# EAGLE schematic 1379_control (EAGLE 9.6.2)

## Sheet 1 of 10
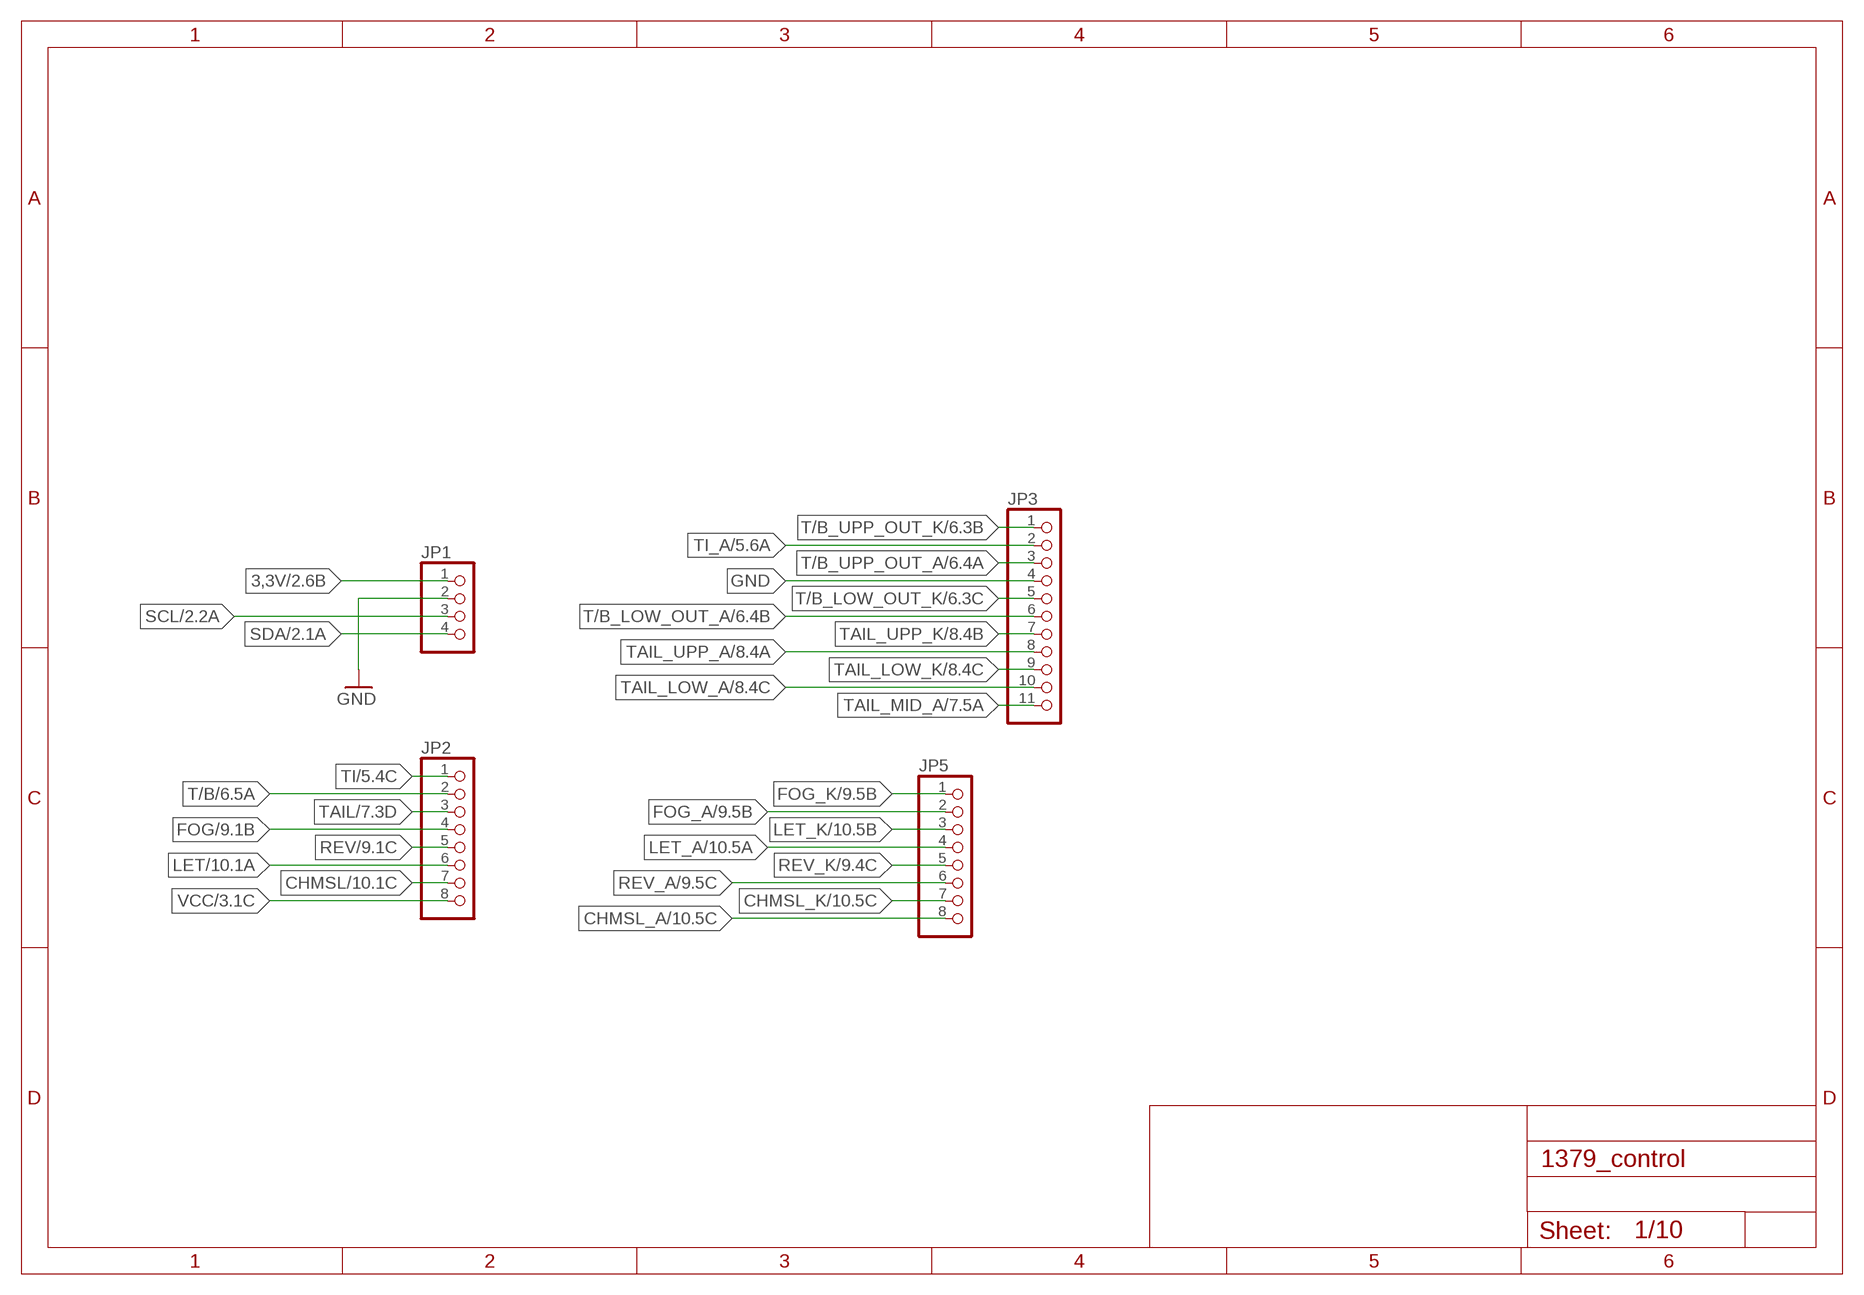
[diagram p0: schematic, sheet 1]

### Parts
JP1  PINHD-1X4  [1X04]
JP2  PINHD-1X8  [1X08]
JP3  PINHD-1X11  [1X11]
JP5  PINHD-1X8  [1X08]

### Nets
3,3V: JP1.1 ; also sheet 2,3,4
CHMSL: JP2.7 ; also sheet 10
CHMSL_A: JP5.8 ; also sheet 10
CHMSL_K: JP5.7 ; also sheet 10
FOG: JP2.4 ; also sheet 9
FOG_A: JP5.2 ; also sheet 9
FOG_K: JP5.1 ; also sheet 9
GND: JP1.2 JP3.4 ; also sheet 2,3,4,5,6,7,8,9,10
LET: JP2.6 ; also sheet 10
LET_A: JP5.4 ; also sheet 10
LET_K: JP5.3 ; also sheet 10
REV: JP2.5 ; also sheet 9
REV_A: JP5.6 ; also sheet 9
REV_K: JP5.5 ; also sheet 9
SCL: JP1.3 ; also sheet 2,3
SDA: JP1.4 ; also sheet 2,3
T/B: JP2.2 ; also sheet 6
T/B_LOW_OUT_A: JP3.6 ; also sheet 6
T/B_LOW_OUT_K: JP3.5 ; also sheet 6
T/B_UPP_OUT_A: JP3.3 ; also sheet 6
T/B_UPP_OUT_K: JP3.1 ; also sheet 6
TAIL: JP2.3 ; also sheet 7
TAIL_LOW_A: JP3.10 ; also sheet 8
TAIL_LOW_K: JP3.9 ; also sheet 8
TAIL_MID_A: JP3.11 ; also sheet 7
TAIL_UPP_A: JP3.8 ; also sheet 8
TAIL_UPP_K: JP3.7 ; also sheet 8
TI: JP2.1 ; also sheet 5
TI_A: JP3.2 ; also sheet 5
VCC: JP2.8 ; also sheet 3

## Sheet 2 of 10
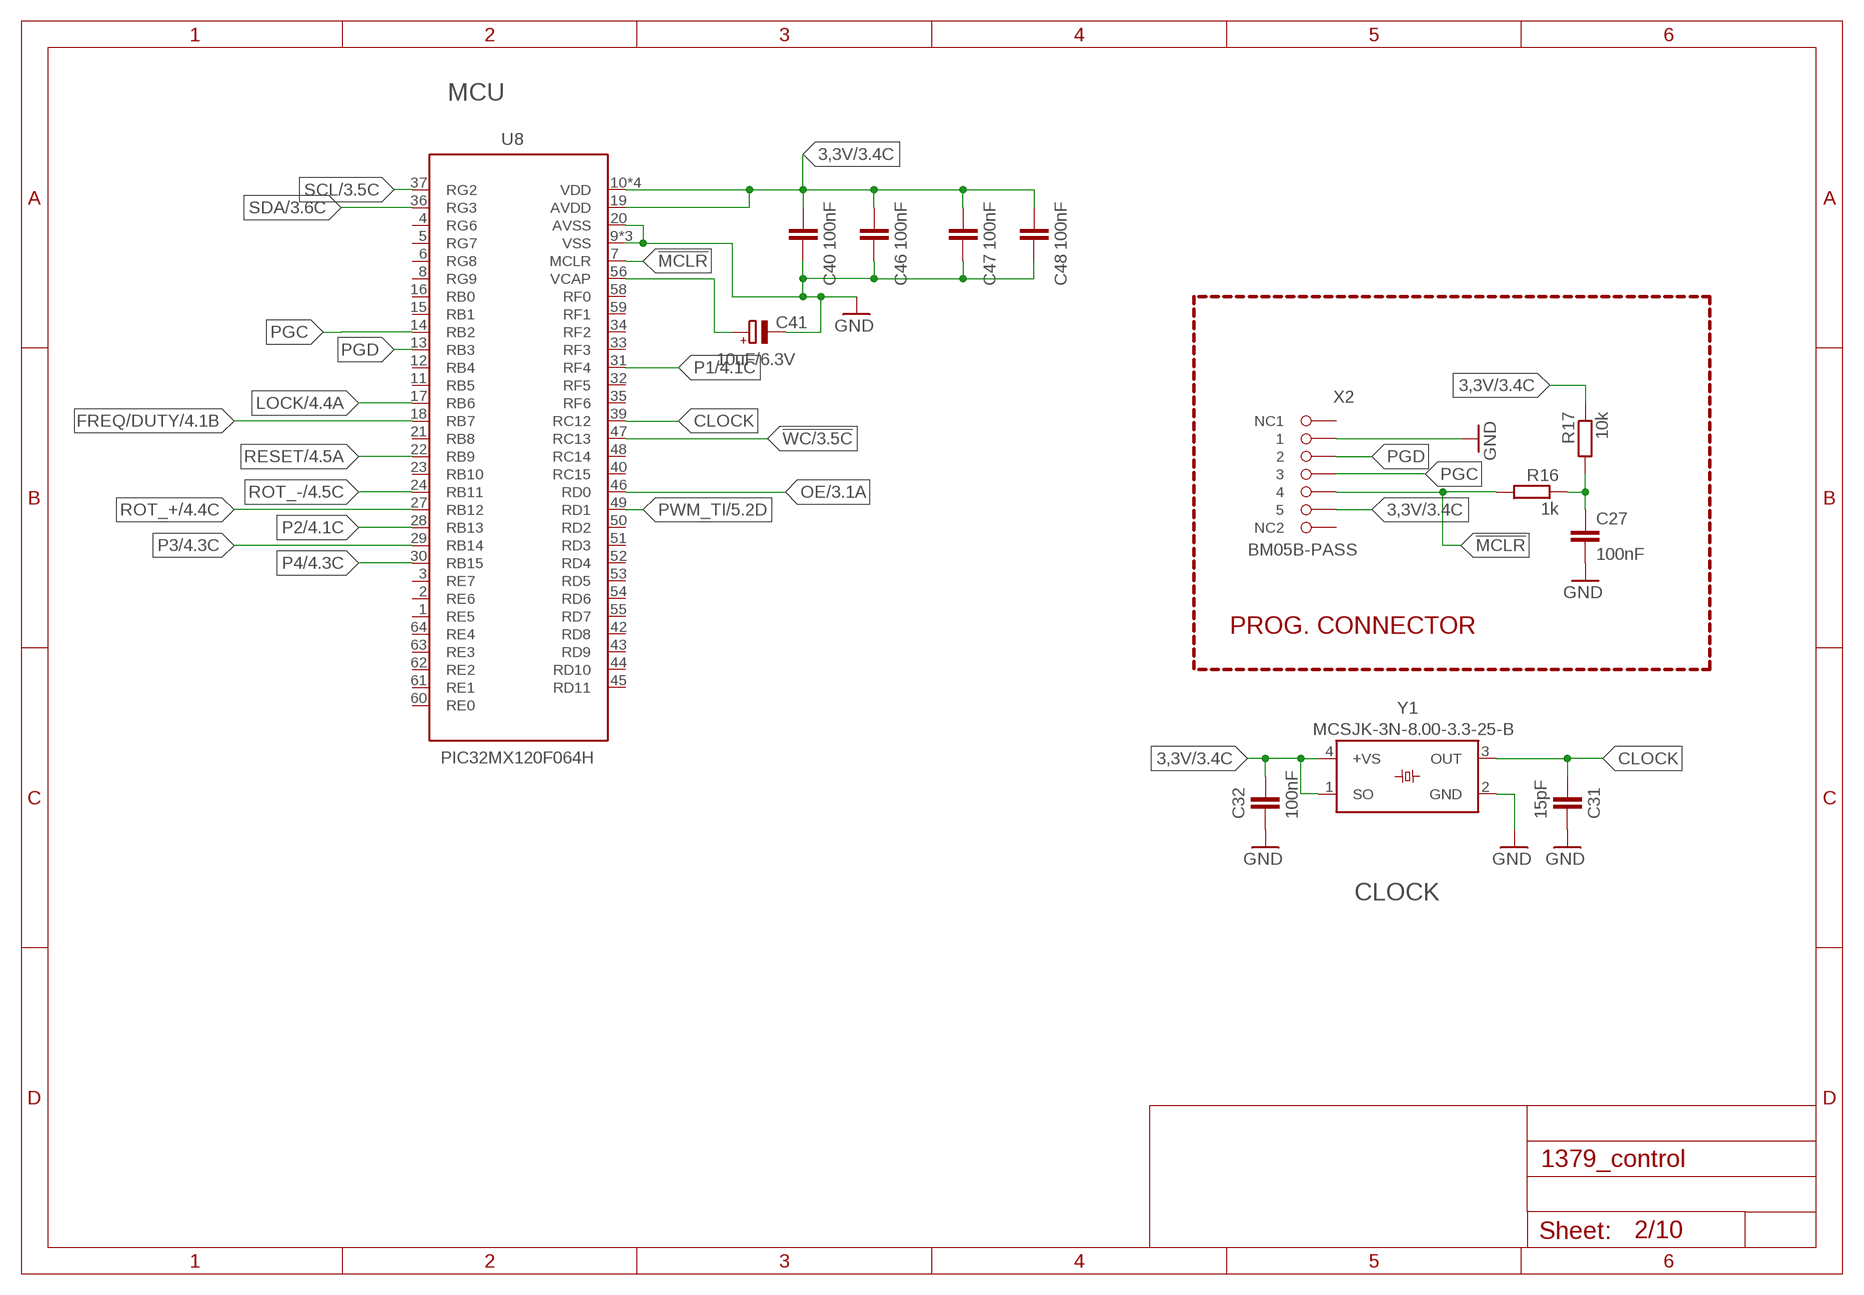
[diagram p1: schematic, sheet 2]

### Parts
C27  100nF  C-EUC0603  [C0603]
C31  15pF  C-EUC0603  [C0603]
C32  100nF  C-EUC0603  [C0603]
C40  100nF  C-EUC0603  [C0603]
C41  10uF/6.3V  CPOL-EUCT3216  [CT3216]
C46  100nF  C-EUC0603  [C0603]
C47  100nF  C-EUC0603  [C0603]
C48  100nF  C-EUC0603  [C0603]
R16  1k  R-EU_R0603  [R0603]
R17  10k  R-EU_R0603  [R0603]
U8  PIC32MX120F064H  [PIC32MX-TQFN]
X2  BM05B-PASS  [BM05B-PASS]
Y1  MCSJK-3N-8.00-3.3-25-B  WE-SPXO_CFPS-104_830205028309  [WE-SPXO_CFPS-104]

### Nets
3,3V: C32.1 C40.1 C46.1 C47.1 C48.1 R17.1 U8.10(VDD) U8.19(AVDD) U8.26(VDD) U8.38(VDD) U8.57(VDD) X2.P$5 Y1.1(SO) Y1.4(+VS) ; also sheet 1,3,4
!MCLR: R16.2 U8.7(MCLR) X2.P$4
!WC: U8.47(RC13) ; also sheet 3
CLOCK: C31.1 U8.39(RC12) Y1.3(OUT)
FREQ/DUTY: U8.18(RB7) ; also sheet 4
GND: C27.2 C31.2 C32.2 C40.2 C41.- C46.2 C47.2 C48.2 U8.9(VSS) U8.20(AVSS) U8.25(VSS) U8.41(VSS) X2.P$1 Y1.2(GND) ; also sheet 1,3,4,5,6,7,8,9,10
LOCK: U8.17(RB6) ; also sheet 4
N$16: C27.1 R16.1 R17.2
N$47: C41.+ U8.56(VCAP)
OE: U8.46(RD0) ; also sheet 3
P1: U8.31(RF4) ; also sheet 4
P2: U8.28(RB13) ; also sheet 4
P3: U8.29(RB14) ; also sheet 4
P4: U8.30(RB15) ; also sheet 4
PGC: U8.14(RB2) X2.P$3
PGD: U8.13(RB3) X2.P$2
PWM_TI: U8.49(RD1) ; also sheet 5
RESET: U8.22(RB9) ; also sheet 4
ROT_+: U8.27(RB12) ; also sheet 4
ROT_-: U8.24(RB11) ; also sheet 4
SCL: U8.37(RG2) ; also sheet 1,3
SDA: U8.36(RG3) ; also sheet 1,3
Unconnected: U8.1(RE5) U8.2(RE6) U8.4(RG6) U8.5(RG7) U8.6(RG8) U8.8(RG9) U8.11(RB5) U8.12(RB4) U8.15(RB1) U8.16(RB0) U8.21(RB8) U8.23(RB10) U8.32(RF5) U8.33(RF3) U8.34(RF2) U8.35(RF6) U8.40(RC15) U8.42(RD8) U8.43(RD9) U8.44(RD10) U8.45(RD11) U8.48(RC14) U8.50(RD2) U8.51(RD3) U8.52(RD4) U8.53(RD5) U8.54(RD6) U8.55(RD7) U8.58(RF0) U8.59(RF1) U8.60(RE0) U8.61(RE1) U8.62(RE2) U8.63(RE3) U8.64(RE4) X2.A(NC1) X2.B(NC2)

### Notes on the sheet
- MCU
- PROG. CONNECTOR
- CLOCK

## Sheet 3 of 10
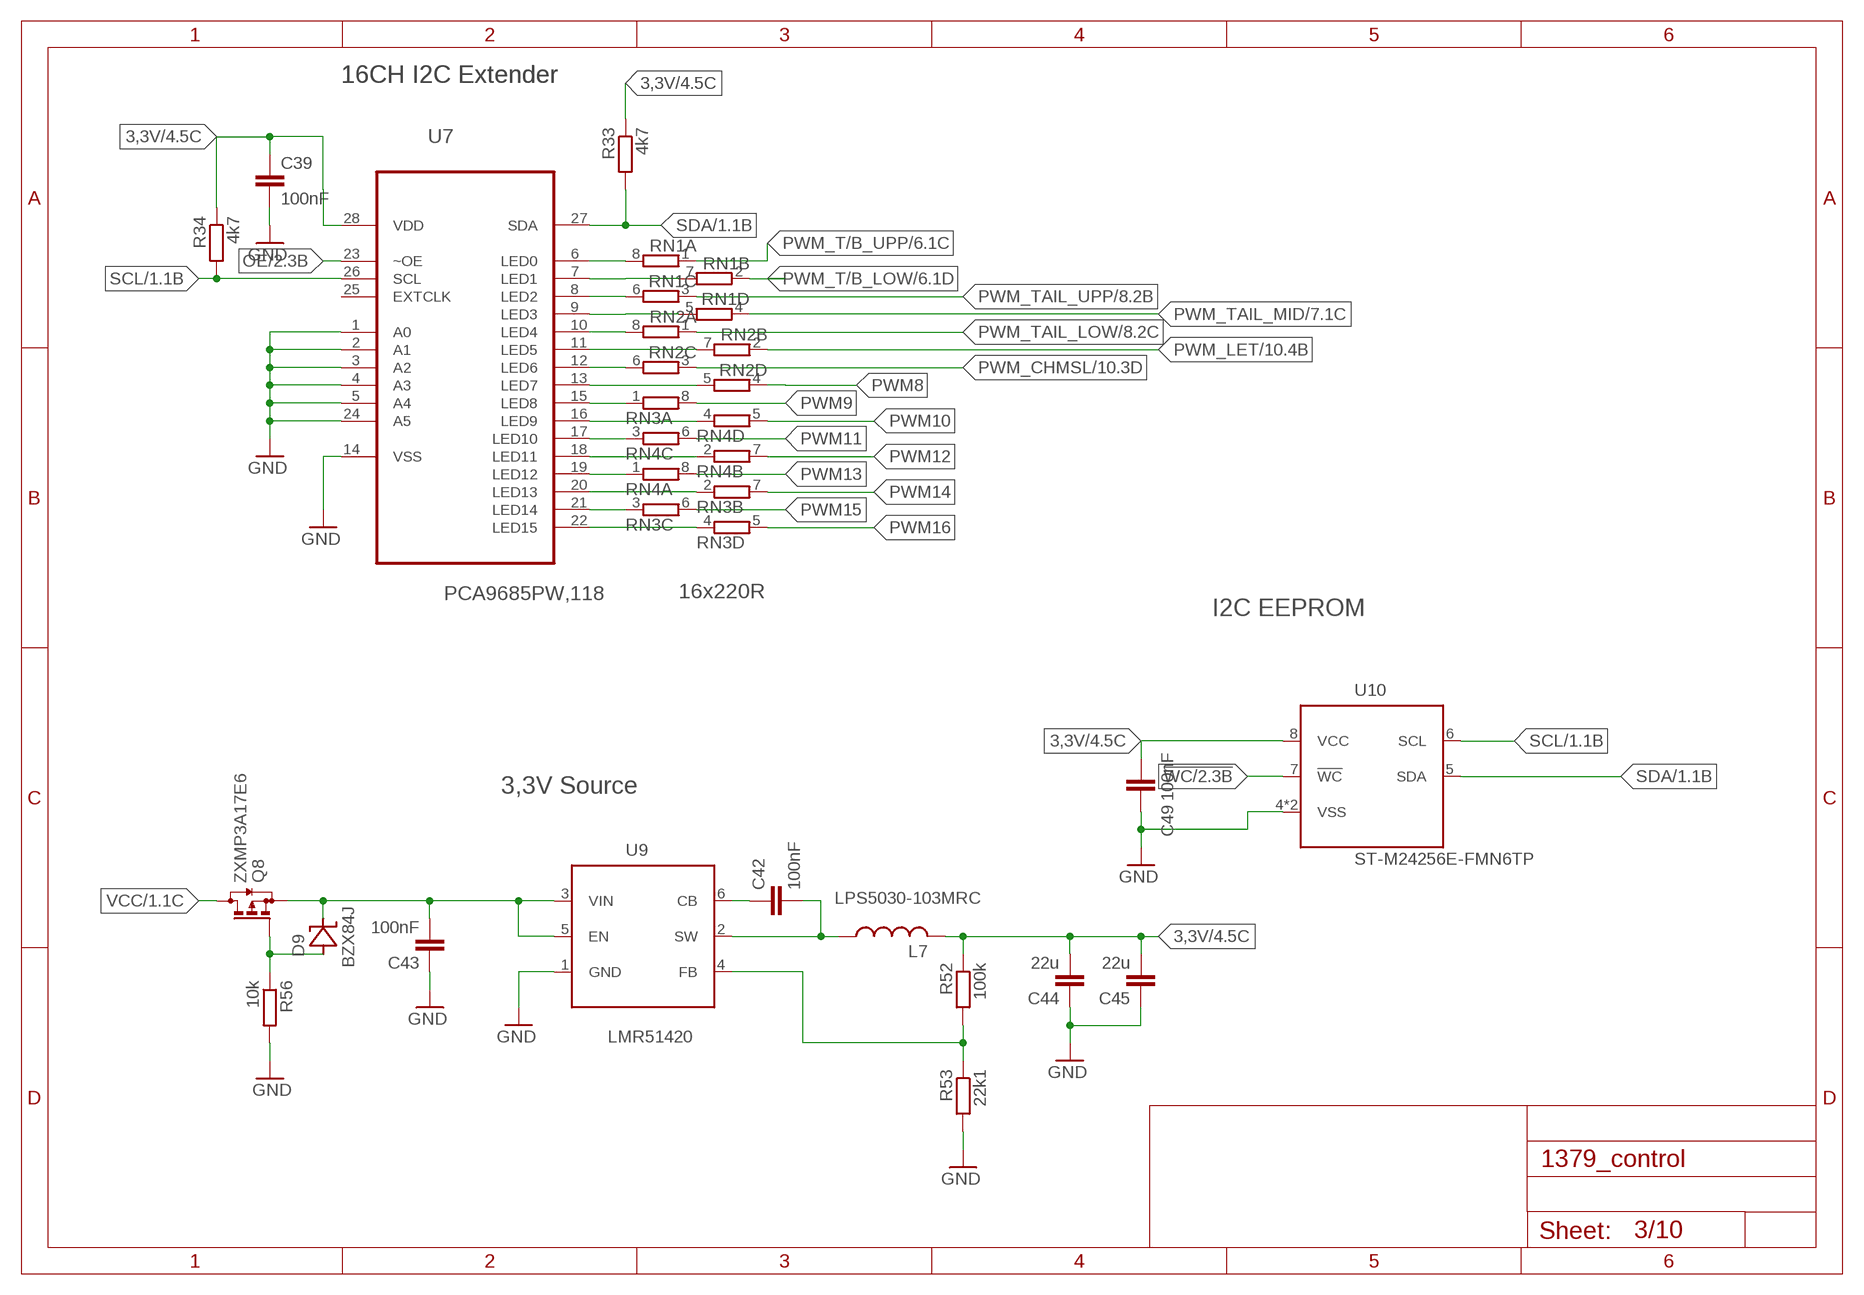
[diagram p2: schematic, sheet 3]

### Parts
C39  100nF  C-EUC0603  [C0603]
C42  100nF  C-EUC0603  [C0603]
C43  100nF  C-EUC0603  [C0603]
C44  22u  C-EUC0603  [C0603]
C45  22u  C-EUC0603  [C0603]
C49  100nF  C-EUC0603  [C0603]
D9  BZX84J  [SOD323]
L7  LPS5030-103MRC  POWER_INDUCTOR5X5  [L_5X5]
Q8  ZXMP3A17E6  [SOT23-6]
R33  4k7  R-EU_R0603  [R0603]
R34  4k7  R-EU_R0603  [R0603]
R52  100k  R-EU_R0603  [R0603]
R53  22k1  R-EU_R0603  [R0603]
R56  10k  R-EU_R0603  [R0603]
RN1  4R-NEXBS8V  [EXBS8V]
RN2  4R-NEXBS8V  [EXBS8V]
RN3  4R-NEXBS8V  [EXBS8V]
RN4  4R-NEXBS8V  [EXBS8V]
U7  PCA9685PW,118  [SOP65P640X110-28N]
U9  LMR51420  [SOT23-6]
U10  ST-M24256E-FMN6TP  [SO-8]

### Nets
3,3V: C39.1 C44.2 C45.2 C49.1 L7.2 R33.1 R34.1 R52.1 U7.28(VDD) U10.8(VCC) ; also sheet 1,2,4
!WC: U10.7(!WC) ; also sheet 2
GND: C39.2 C43.1 C44.1 C45.1 C49.2 R53.2 R56.2 U7.1(A0) U7.2(A1) U7.3(A2) U7.4(A3) U7.5(A4) U7.14(VSS) U7.24(A5) U9.1(GND) U10.4(VSS) U10.EP(VSS) ; also sheet 1,2,4,5,6,7,8,9,10
N$21: RN1.8 U7.6(LED0)
N$22: RN3.1 U7.15(LED8)
N$23: RN1.7 U7.7(LED1)
N$26: RN4.4 U7.16(LED9)
N$27: RN1.6 U7.8(LED2)
N$29: RN4.3 U7.17(LED10)
N$34: RN1.5 U7.9(LED3)
N$35: RN2.8 U7.10(LED4)
N$36: RN2.7 U7.11(LED5)
N$37: RN2.6 U7.12(LED6)
N$38: RN2.5 U7.13(LED7)
N$39: RN4.2 U7.18(LED11)
N$40: RN4.1 U7.19(LED12)
N$41: RN3.2 U7.20(LED13)
N$44: RN3.3 U7.21(LED14)
N$45: RN3.4 U7.22(LED15)
N$48: R52.2 R53.1 U9.4(FB)
N$52: C42.2 L7.1 U9.2(SW)
N$53: C42.1 U9.6(CB)
N$54: D9.A Q8.3(G) R56.1
N$55: C43.2 D9.C Q8.4(S) U9.3(VIN) U9.5(EN)
OE: U7.23(~OE) ; also sheet 2
PWM8: RN2.4
PWM9: RN3.8
PWM10: RN4.5
PWM11: RN4.6
PWM12: RN4.7
PWM13: RN4.8
PWM14: RN3.7
PWM15: RN3.6
PWM16: RN3.5
PWM_CHMSL: RN2.3 ; also sheet 10
PWM_LET: RN2.2 ; also sheet 10
PWM_T/B_LOW: RN1.2 ; also sheet 6
PWM_T/B_UPP: RN1.1 ; also sheet 6
PWM_TAIL_LOW: RN2.1 ; also sheet 8
PWM_TAIL_MID: RN1.4 ; also sheet 7
PWM_TAIL_UPP: RN1.3 ; also sheet 8
SCL: R34.2 U7.26(SCL) U10.6(SCL) ; also sheet 1,2
SDA: R33.2 U7.27(SDA) U10.5(SDA) ; also sheet 1,2
VCC: Q8.1(D) Q8.2(D) Q8.5(D) Q8.6(D) ; also sheet 1
Unconnected: U7.25(EXTCLK)

### Notes on the sheet
- 16CH I2C Extender | 16CH I2C Extender
- 16x220R
- I2C EEPROM
- 3,3V Source

## Sheet 4 of 10
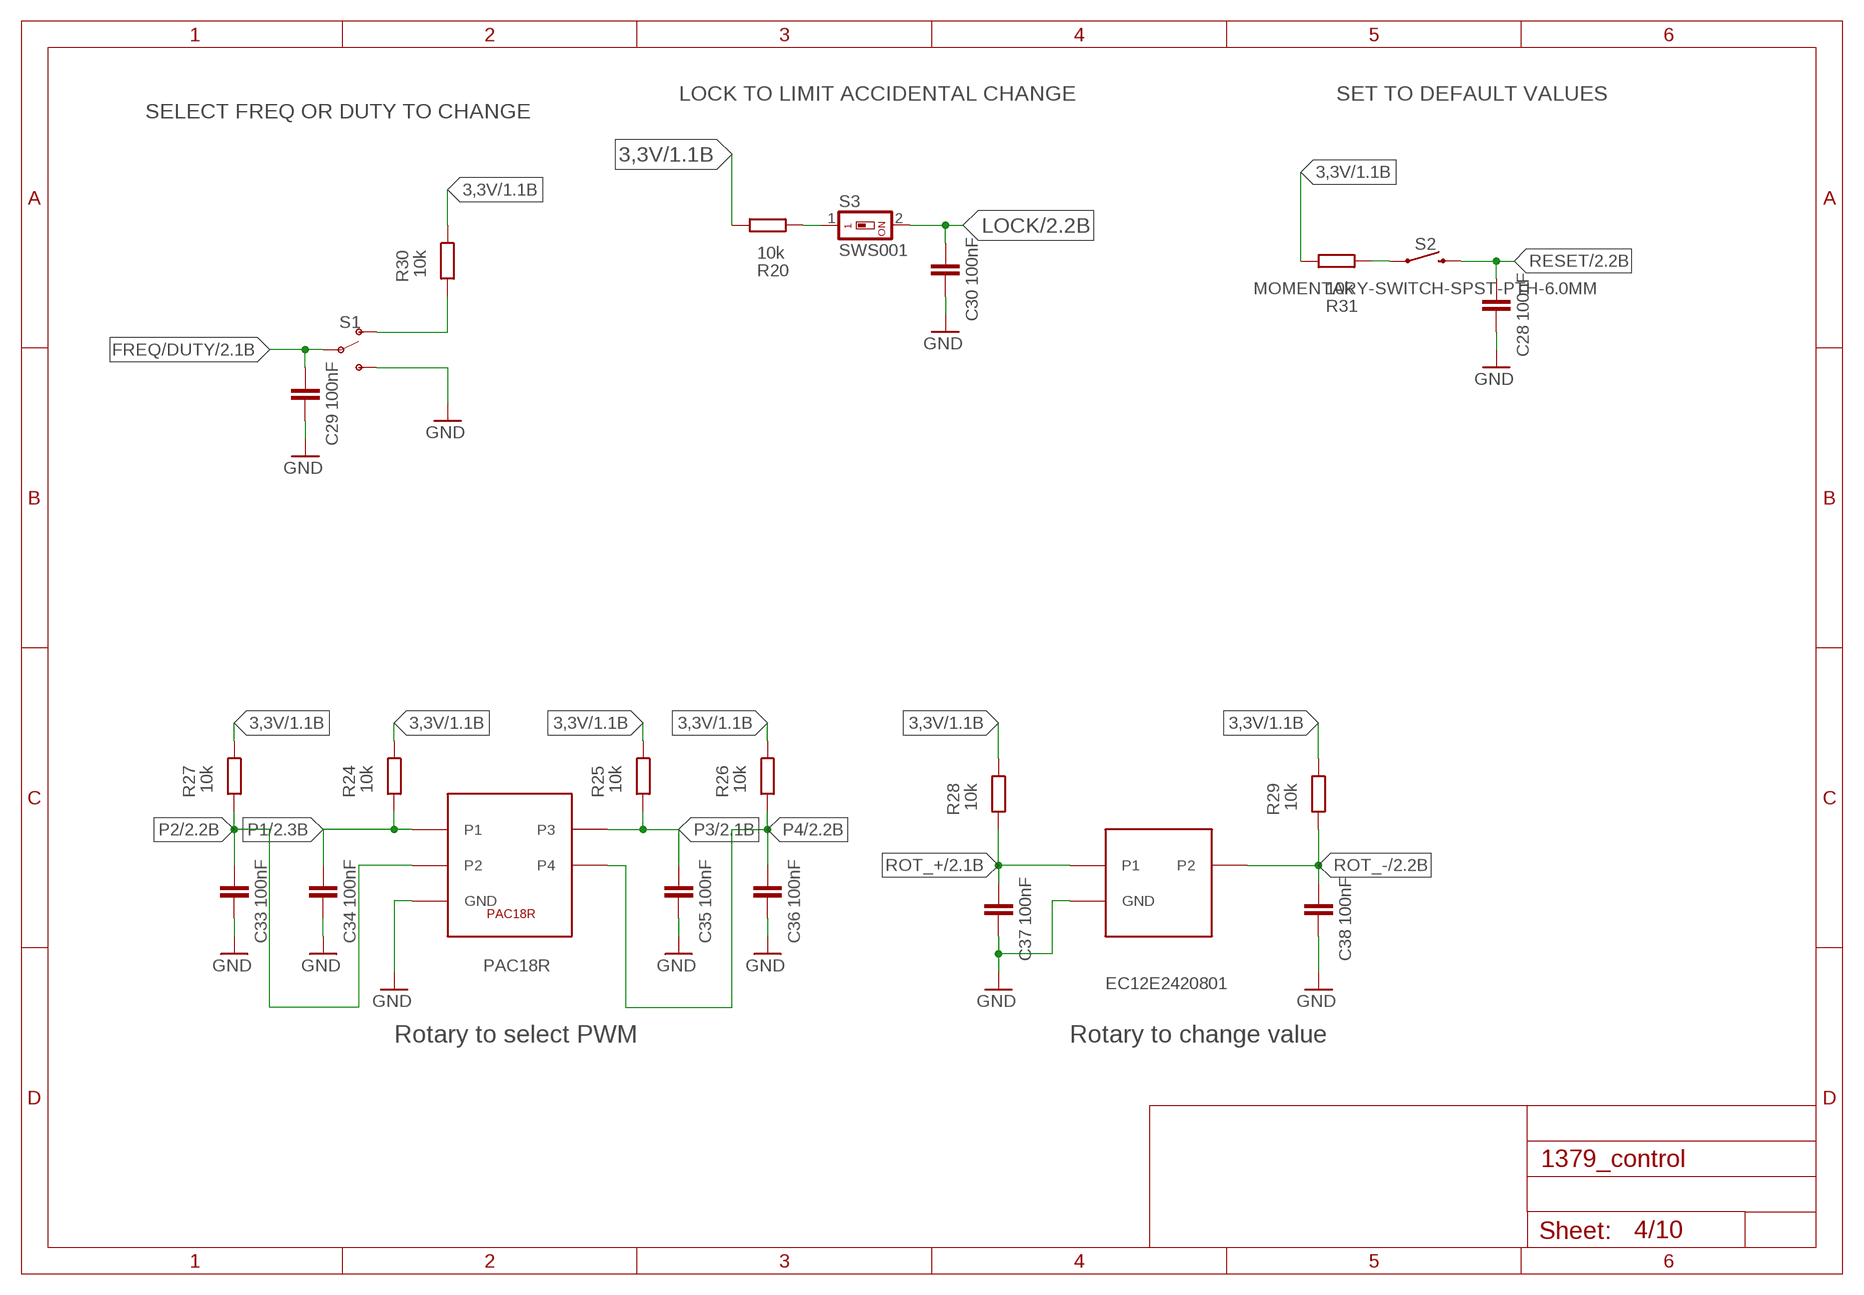
[diagram p3: schematic, sheet 4]

### Parts
C28  100nF  C-EUC0603  [C0603]
C29  100nF  C-EUC0603  [C0603]
C30  100nF  C-EUC0603  [C0603]
C33  100nF  C-EUC0603  [C0603]
C34  100nF  C-EUC0603  [C0603]
C35  100nF  C-EUC0603  [C0603]
C36  100nF  C-EUC0603  [C0603]
C37  100nF  C-EUC0603  [C0603]
C38  100nF  C-EUC0603  [C0603]
R20  10k  R-EU_R0603  [R0603]
R24  10k  R-EU_R0603  [R0603]
R25  10k  R-EU_R0603  [R0603]
R26  10k  R-EU_R0603  [R0603]
R27  10k  R-EU_R0603  [R0603]
R28  10k  R-EU_R0603  [R0603]
R29  10k  R-EU_R0603  [R0603]
R30  10k  R-EU_R0603  [R0603]
R31  10k  R-EU_R0603  [R0603]
S1  SWITCH-SPDT-PTH-11.6X4.0MM  [SWITCH_SPDT_PTH_11.6X4.0MM]
S2  MOMENTARY-SWITCH-SPST-PTH-6.0MM  [TACTILE_SWITCH_PTH_6.0MM]
S3  SWS001  [SMS-001]
X1  ENODER_ROTARY  [ENCODER]
X3  ENCODER-2  [ENCODER-2]

### Nets
3,3V: R20.1 R24.1 R25.1 R26.1 R27.1 R28.1 R29.1 R30.1 R31.1 ; also sheet 1,2,3
FREQ/DUTY: C29.1 S1.2(P) ; also sheet 2
GND: C28.2 C29.2 C30.2 C33.2 C34.2 C35.2 C36.2 C37.2 C38.2 S1.3(S) X1.P$3(GND) X3.P$2(GND) ; also sheet 1,2,3,5,6,7,8,9,10
LOCK: C30.1 S3.2 ; also sheet 2
N$18: R31.2 S2.1
N$19: R30.2 S1.1(O)
N$20: R20.2 S3.1
P1: C34.1 R24.2 X1.P$5(P1) ; also sheet 2
P2: C33.1 R27.2 X1.P$1(P2) ; also sheet 2
P3: C35.1 R25.2 X1.P$4(P3) ; also sheet 2
P4: C36.1 R26.2 X1.P$2(P4) ; also sheet 2
RESET: C28.1 S2.3 ; also sheet 2
ROT_+: C37.1 R28.2 X3.P$1(P1) ; also sheet 2
ROT_-: C38.1 R29.2 X3.P$3(P2) ; also sheet 2

### Notes on the sheet
- LOCK TO LIMIT ACCIDENTAL CHANGE | SET TO DEFAULT VALUES
- SELECT FREQ OR DUTY TO CHANGE
- PAC18R
- EC12E2420801
- Rotary to select PWM | Rotary to change value

## Sheet 5 of 10
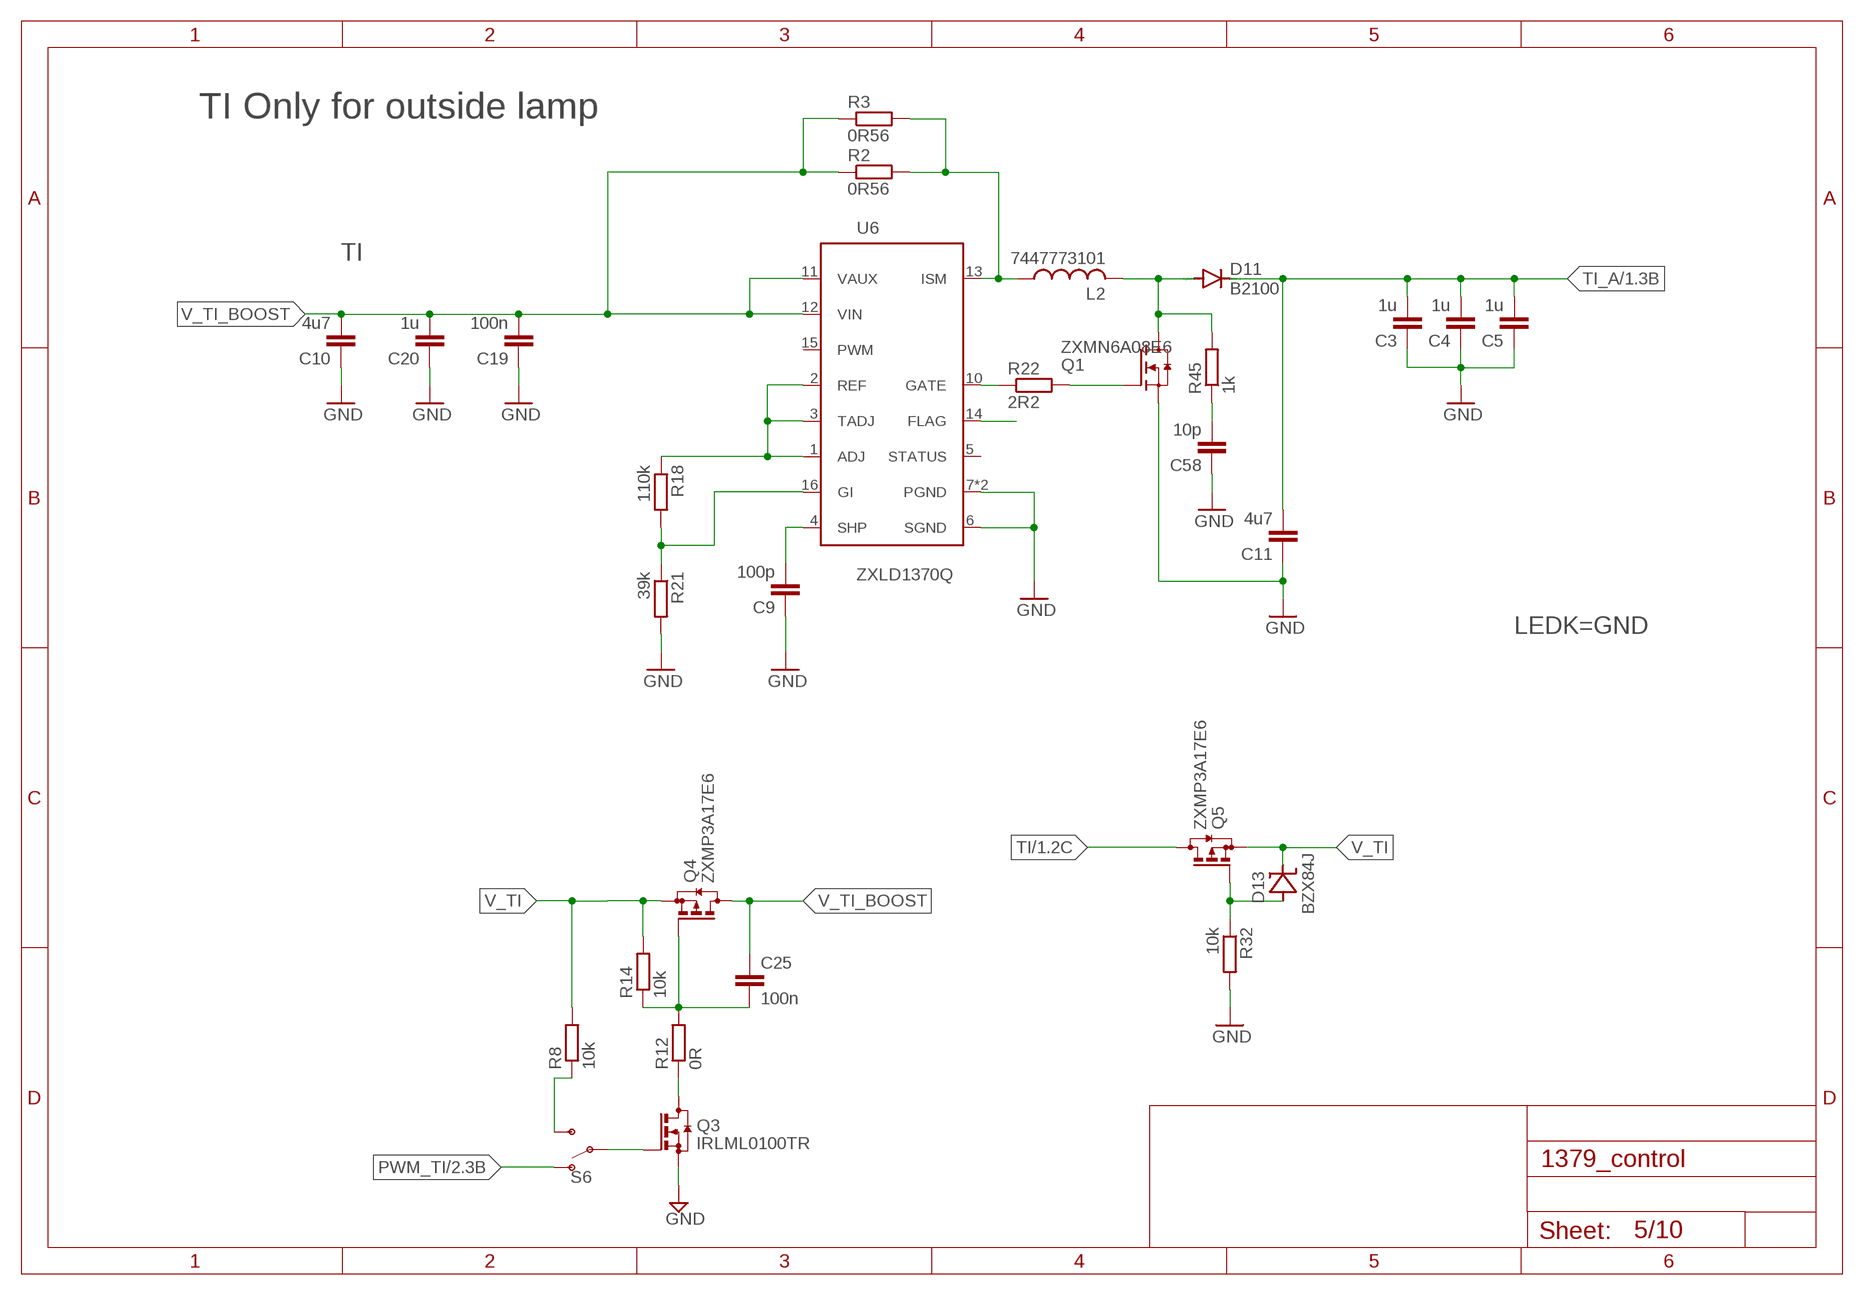
[diagram p4: schematic, sheet 5]

### Parts
C3  1u  C-EUC1206  [C1206]
C4  1u  C-EUC1206  [C1206]
C5  1u  C-EUC1206  [C1206]
C9  100p  C-EUC0603  [C0603]
C10  4u7  C-EUC0603  [C0603]
C11  4u7  C-EUC0603  [C0603]
C19  100n  C-EUC0603  [C0603]
C20  1u  C-EUC0603  [C0603]
C25  100n  C-EUC0603  [C0603]
C58  10p  C-EUC0603  [C0603]
D11  B2100  DIODE-SMB  [SMB]
D13  BZX84J  [SOD323]
L2  7447773101  POWER_INDUCTOR7.4X7.4  [L_7.4X7.4]
Q1  ZXMN6A08E6  [SOT23-6]
Q3  IRLML0100TR  [SOT23]
Q4  ZXMP3A17E6  [SOT23-6]
Q5  ZXMP3A17E6  [SOT23-6]
R2  0R56  R-EU_R0805  [R0805]
R3  0R56  R-EU_R0805  [R0805]
R8  10k  R-EU_R0603  [R0603]
R12  0R  R-EU_R0603  [R0603]
R14  10k  R-EU_R0603  [R0603]
R18  110k  R-EU_R0603  [R0603]
R21  39k  R-EU_R0603  [R0603]
R22  2R2  R-EU_R0603  [R0603]
R32  10k  R-EU_R0603  [R0603]
R45  1k  R-EU_R0603  [R0603]
S6  SWITCH-SPDT-PTH-11.6X4.0MM  [SWITCH_SPDT_PTH_11.6X4.0MM]
U6  ZXLD1370Q  [TSSOP16E]

### Nets
GND: C3.1 C4.1 C5.1 C9.1 C10.1 C11.1 C19.1 C20.1 C58.1 Q1.4(S) Q3.2(S) R21.2 R32.2 U6.6(SGND) U6.7(PGND) U6.EXP(PGND) ; also sheet 1,2,3,4,6,7,8,9,10
N$10: R8.1 S6.3(S)
N$15: C9.2 U6.4(SHP)
N$24: L2.1 R2.2 R3.2 U6.13(ISM)
N$25: D11.A L2.2 Q1.1(D) Q1.2(D) Q1.5(D) Q1.6(D) R45.2
N$28: R18.2 R21.1 U6.16(GI)
N$30: R18.1 U6.1(ADJ) U6.2(REF) U6.3(TADJ)
N$31: R22.1 U6.10(GATE)
N$32: Q1.3(G) R22.2
N$42: Q3.3(D) R12.1
N$43: C25.2 Q4.3(G) R12.2 R14.1
N$46: D13.A Q5.3(G) R32.1
N$51: U6.14(FLAG)
N$65: C58.2 R45.1
N$67: Q3.1(G) S6.2(P)
PWM_TI: S6.1(O) ; also sheet 2
TI: Q5.1(D) Q5.2(D) Q5.5(D) Q5.6(D) ; also sheet 1
TI_A: C3.2 C4.2 C5.2 C11.2 D11.C ; also sheet 1
V_TI: D13.C Q4.4(S) Q5.4(S) R8.2 R14.2
V_TI_BOOST: C10.2 C19.2 C20.2 C25.1 Q4.1(D) Q4.2(D) Q4.5(D) Q4.6(D) R2.1 R3.1 U6.11(VAUX) U6.12(VIN)
Unconnected: U6.5(STATUS)

### Notes on the sheet
- TI Only for outside lamp
- TI
- LEDK=GND

## Sheet 6 of 10
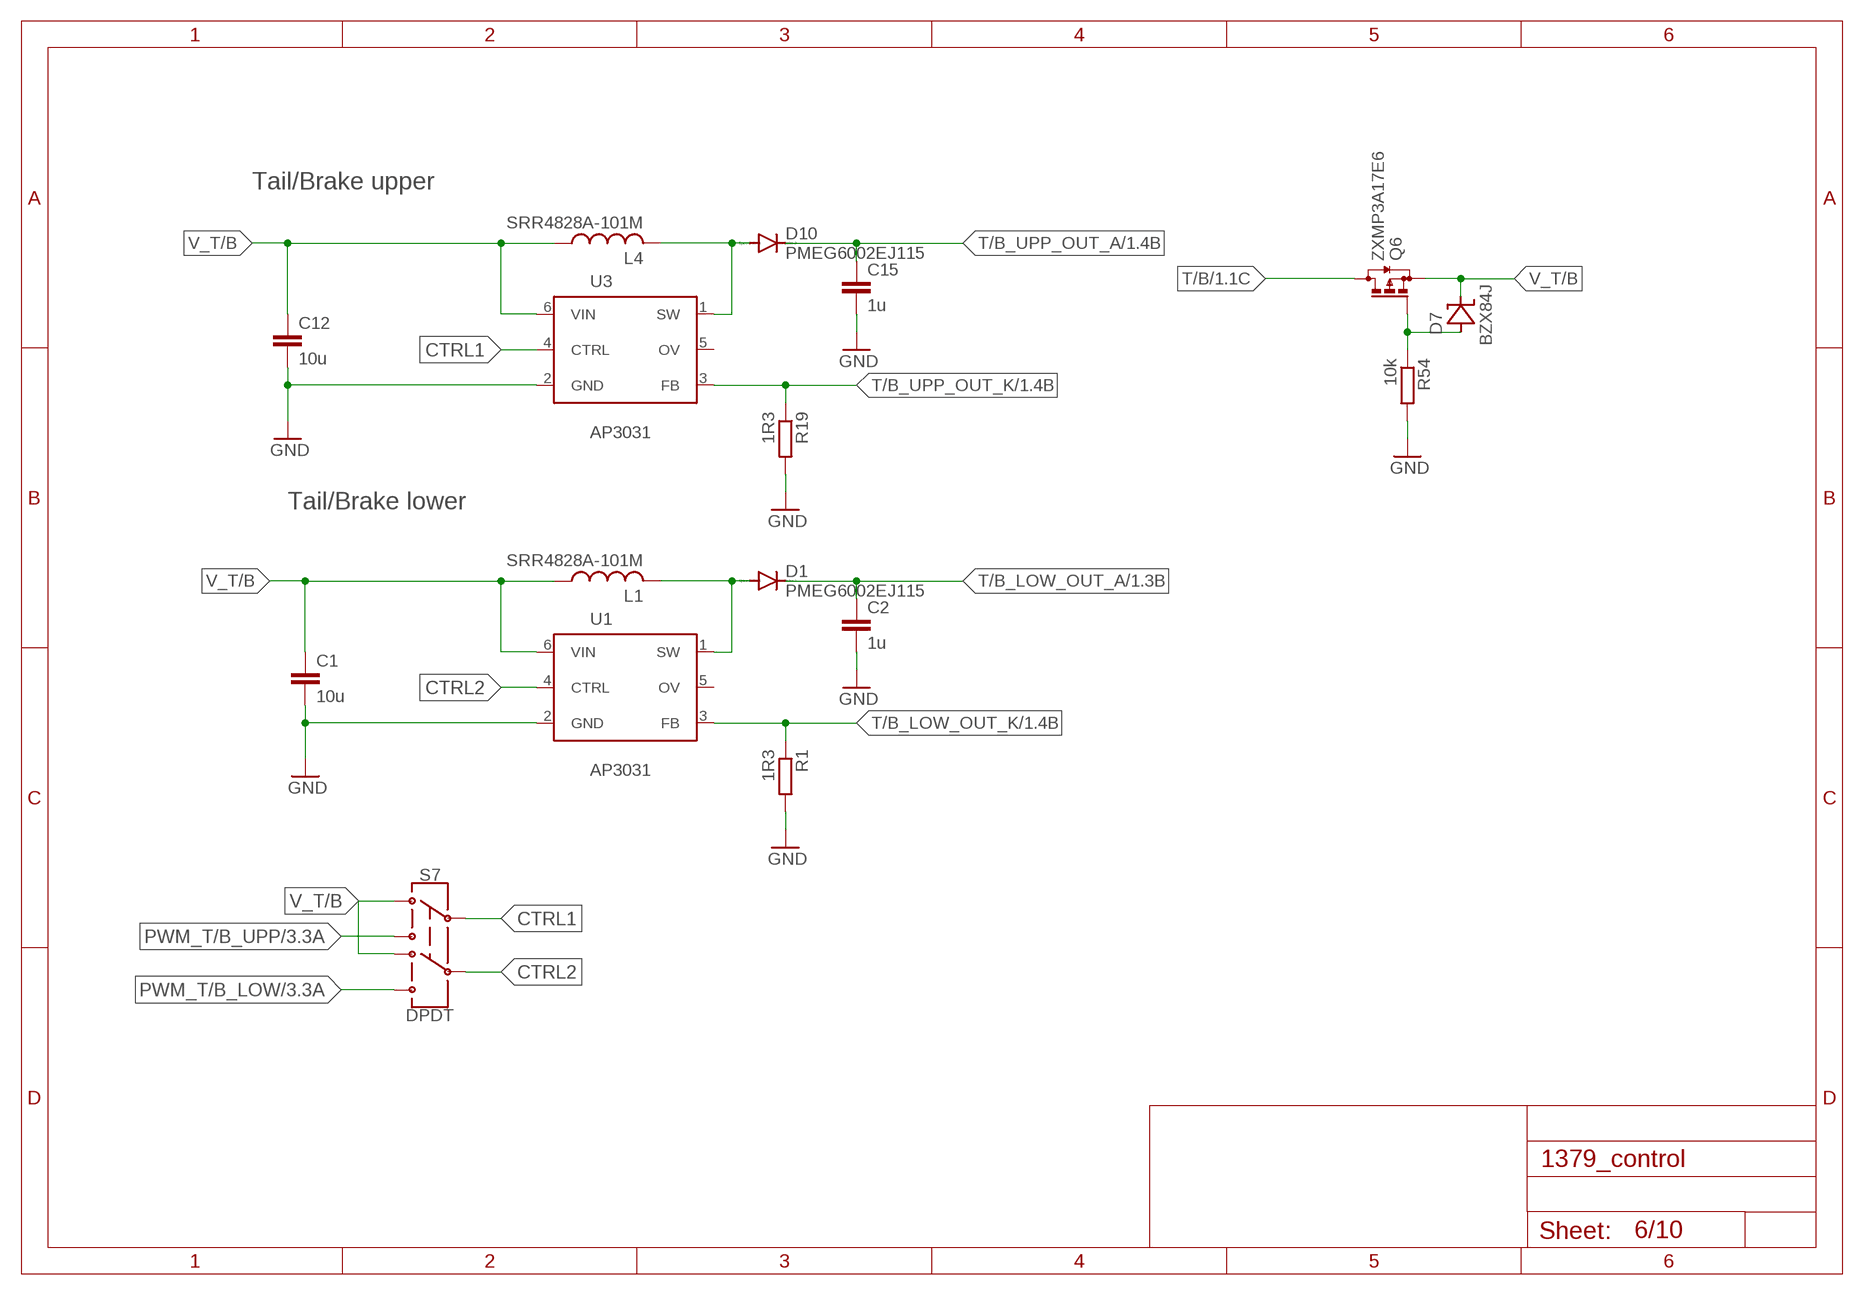
[diagram p5: schematic, sheet 6]

### Parts
C1  10u  C-EUC0805  [C0805]
C2  1u  C-EUC0805  [C0805]
C12  10u  C-EUC0805  [C0805]
C15  1u  C-EUC0805  [C0805]
D1  PMEG6002EJ115  DIODE-SOD323-R  [SOD323-R]
D7  BZX84J  [SOD323]
D10  PMEG6002EJ115  DIODE-SOD323-R  [SOD323-R]
L1  SRR4828A-101M  POWER_INDUCTOR5X5  [L_5X5]
L4  SRR4828A-101M  POWER_INDUCTOR5X5  [L_5X5]
Q6  ZXMP3A17E6  [SOT23-6]
R1  1R3  R-EU_R0805  [R0805]
R19  1R3  R-EU_R0805  [R0805]
R54  10k  R-EU_R0603  [R0603]
S7  DPDT  [SWITCH_DPDT_PTH_GPI-152-3013]
U1  AP3031  [SOT23-6]
U3  AP3031  [SOT23-6]

### Nets
CTRL1: S7.C@1 U3.4(CTRL)
CTRL2: S7.C@2 U1.4(CTRL)
GND: C1.2 C2.2 C12.2 C15.2 R1.2 R19.2 R54.2 U1.2(GND) U3.2(GND) ; also sheet 1,2,3,4,5,7,8,9,10
N$1: D1.A L1.2 U1.1(SW)
N$8: D10.A L4.2 U3.1(SW)
N$49: D7.A Q6.3(G) R54.1
PWM_T/B_LOW: S7.21 ; also sheet 3
PWM_T/B_UPP: S7.11 ; also sheet 3
T/B: Q6.1(D) Q6.2(D) Q6.5(D) Q6.6(D) ; also sheet 1
T/B_LOW_OUT_A: C2.1 D1.C ; also sheet 1
T/B_LOW_OUT_K: R1.1 U1.3(FB) ; also sheet 1
T/B_UPP_OUT_A: C15.1 D10.C ; also sheet 1
T/B_UPP_OUT_K: R19.1 U3.3(FB) ; also sheet 1
V_T/B: C1.1 C12.1 D7.C L1.1 L4.1 Q6.4(S) S7.10 S7.20 U1.6(VIN) U3.6(VIN)
Unconnected: U1.5(OV) U3.5(OV)

### Notes on the sheet
- Tail/Brake upper
- Tail/Brake lower

## Sheet 7 of 10
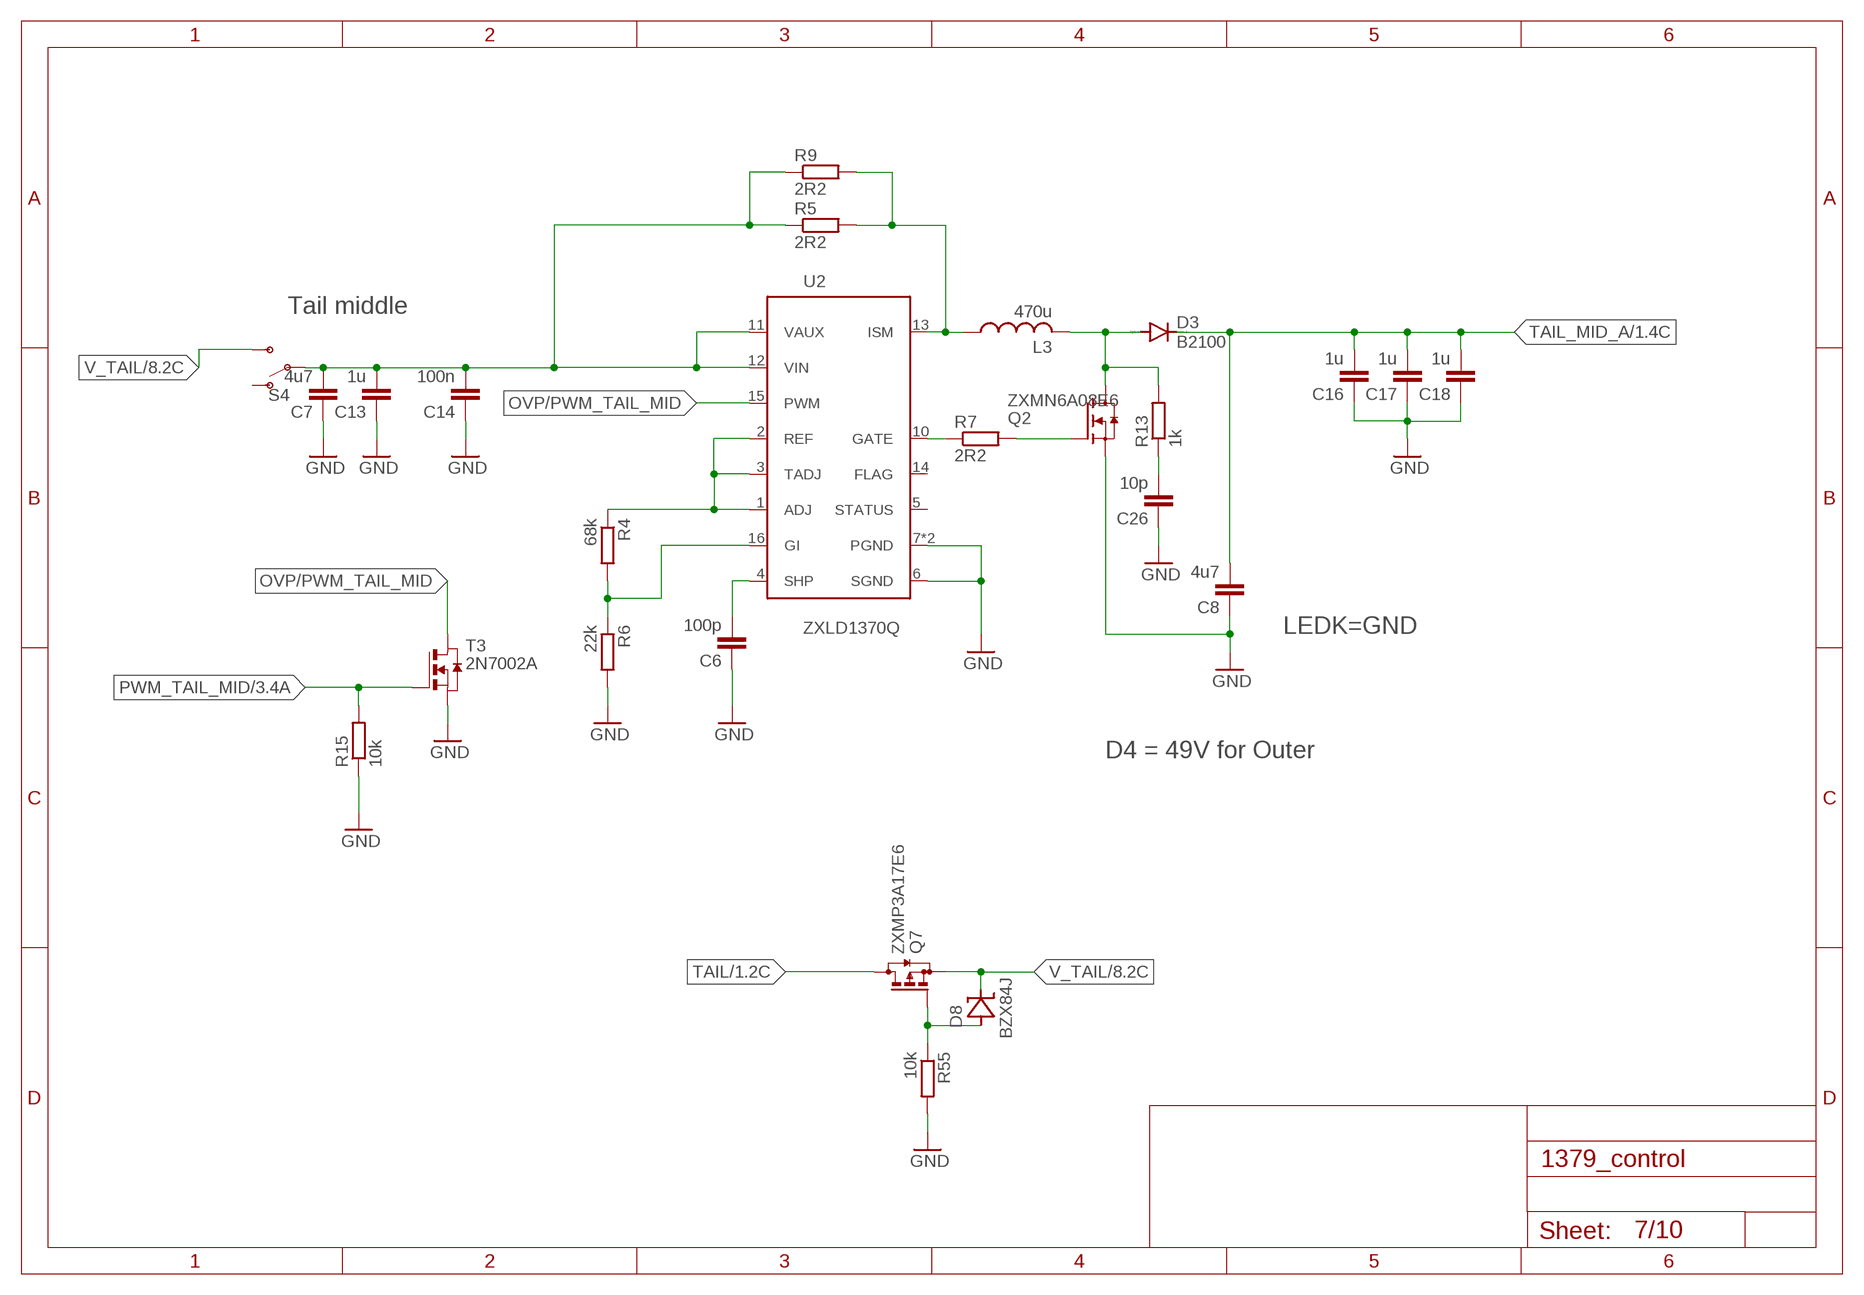
[diagram p6: schematic, sheet 7]

### Parts
C6  100p  C-EUC0603  [C0603]
C7  4u7  C-EUC0603  [C0603]
C8  4u7  C-EUC0603  [C0603]
C13  1u  C-EUC0603  [C0603]
C14  100n  C-EUC0603  [C0603]
C16  1u  C-EUC1206  [C1206]
C17  1u  C-EUC1206  [C1206]
C18  1u  C-EUC1206  [C1206]
C26  10p  C-EUC0603  [C0603]
D3  B2100  DIODE-SMB  [SMB]
D8  BZX84J  [SOD323]
L3  470u  POWER_INDUCTOR7.4X7.4  [L_7.4X7.4]
Q2  ZXMN6A08E6  [SOT23-6]
Q7  ZXMP3A17E6  [SOT23-6]
R4  68k  R-EU_R0603  [R0603]
R5  2R2  R-EU_R0805  [R0805]
R6  22k  R-EU_R0603  [R0603]
R7  2R2  R-EU_R0603  [R0603]
R9  2R2  R-EU_R0805  [R0805]
R13  1k  R-EU_R0603  [R0603]
R15  10k  R-EU_R0603  [R0603]
R55  10k  R-EU_R0603  [R0603]
S4  SWITCH-SPDT-PTH-11.6X4.0MM  [SWITCH_SPDT_PTH_11.6X4.0MM]
T3  2N7002A  NMOSSOT23  [SOT-23]
U2  ZXLD1370Q  [TSSOP16E]

### Nets
GND: C6.1 C7.1 C8.1 C13.1 C14.1 C16.1 C17.1 C18.1 C26.1 Q2.4(S) R6.2 R15.1 R55.2 T3.2(S) U2.6(SGND) U2.7(PGND) U2.EXP(PGND) ; also sheet 1,2,3,4,5,6,8,9,10
N$2: C6.2 U2.4(SHP)
N$3: L3.1 R5.2 R9.2 U2.13(ISM)
N$4: D3.A L3.2 Q2.1(D) Q2.2(D) Q2.5(D) Q2.6(D) R13.2
N$5: R4.2 R6.1 U2.16(GI)
N$6: R4.1 U2.1(ADJ) U2.2(REF) U2.3(TADJ)
N$7: R7.1 U2.10(GATE)
N$9: Q2.3(G) R7.2
N$17: C26.2 R13.1
N$50: D8.A Q7.3(G) R55.1
OVP/PWM_TAIL_MID: T3.1(D) U2.15(PWM)
PWM_TAIL_MID: R15.2 T3.3(G) ; also sheet 3
TAIL: Q7.1(D) Q7.2(D) Q7.5(D) Q7.6(D) ; also sheet 1
TAIL_MID_A: C8.2 C16.2 C17.2 C18.2 D3.C ; also sheet 1
V_TAIL: D8.C Q7.4(S) S4.3(S) ; also sheet 8
V_TAIL1: C7.2 C13.2 C14.2 R5.1 R9.1 S4.2(P) U2.11(VAUX) U2.12(VIN)
Unconnected: S4.1(O) U2.5(STATUS)

### Notes on the sheet
- Tail middle
- LEDK=GND
- D4 = 49V for Outer

## Sheet 8 of 10
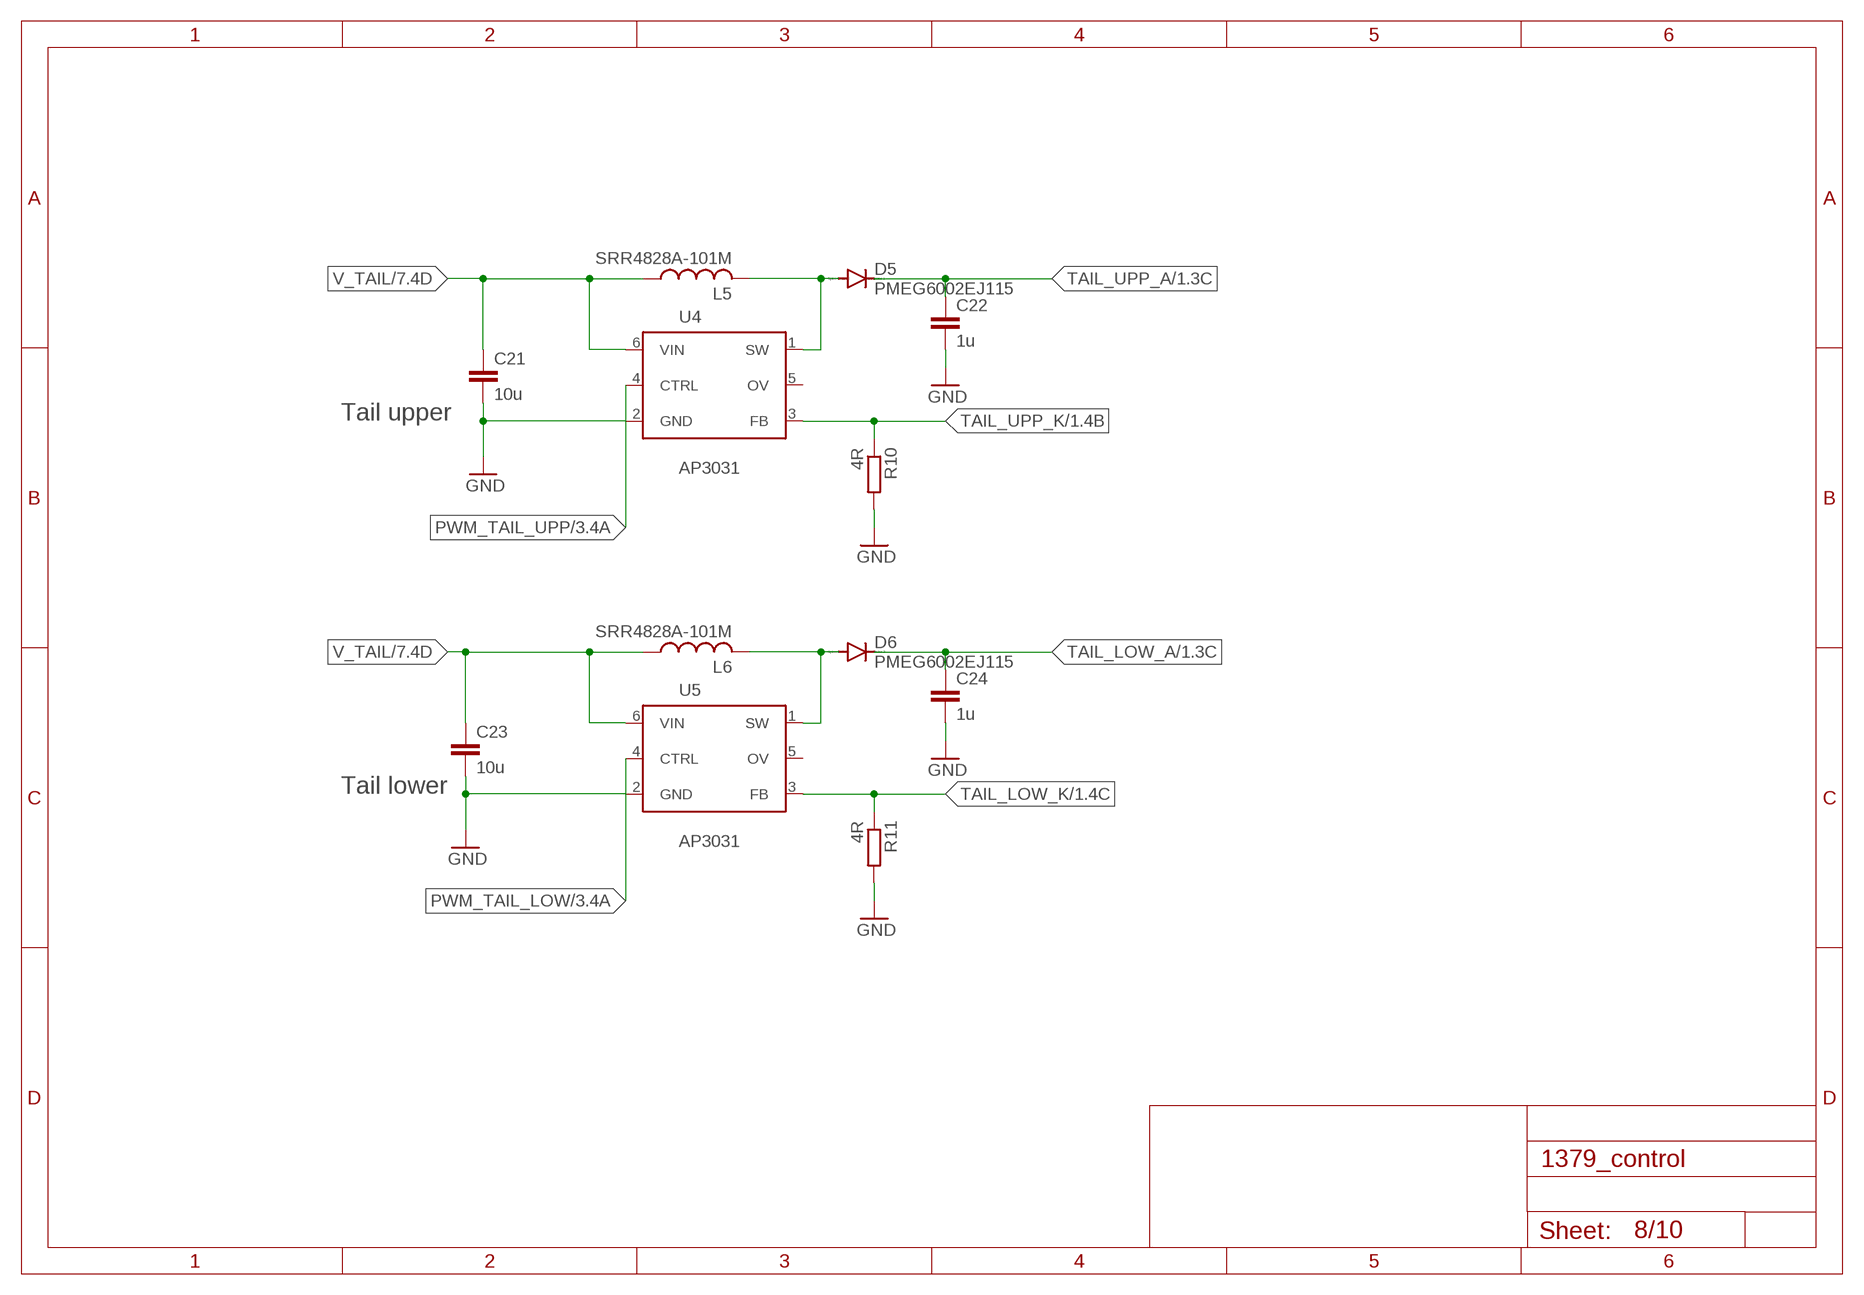
[diagram p7: schematic, sheet 8]

### Parts
C21  10u  C-EUC0805  [C0805]
C22  1u  C-EUC0805  [C0805]
C23  10u  C-EUC0805  [C0805]
C24  1u  C-EUC0805  [C0805]
D5  PMEG6002EJ115  DIODE-SOD323-R  [SOD323-R]
D6  PMEG6002EJ115  DIODE-SOD323-R  [SOD323-R]
L5  SRR4828A-101M  POWER_INDUCTOR5X5  [L_5X5]
L6  SRR4828A-101M  POWER_INDUCTOR5X5  [L_5X5]
R10  4R  R-EU_R0805  [R0805]
R11  4R  R-EU_R0805  [R0805]
U4  AP3031  [SOT23-6]
U5  AP3031  [SOT23-6]

### Nets
GND: C21.2 C22.2 C23.2 C24.2 R10.2 R11.2 U4.2(GND) U5.2(GND) ; also sheet 1,2,3,4,5,6,7,9,10
N$11: D5.A L5.2 U4.1(SW)
N$12: D6.A L6.2 U5.1(SW)
PWM_TAIL_LOW: U5.4(CTRL) ; also sheet 3
PWM_TAIL_UPP: U4.4(CTRL) ; also sheet 3
TAIL_LOW_A: C24.1 D6.C ; also sheet 1
TAIL_LOW_K: R11.1 U5.3(FB) ; also sheet 1
TAIL_UPP_A: C22.1 D5.C ; also sheet 1
TAIL_UPP_K: R10.1 U4.3(FB) ; also sheet 1
V_TAIL: C21.1 C23.1 L5.1 L6.1 U4.6(VIN) U5.6(VIN) ; also sheet 7
Unconnected: U4.5(OV) U5.5(OV)

### Notes on the sheet
- Tail upper
- Tail lower

## Sheet 9 of 10
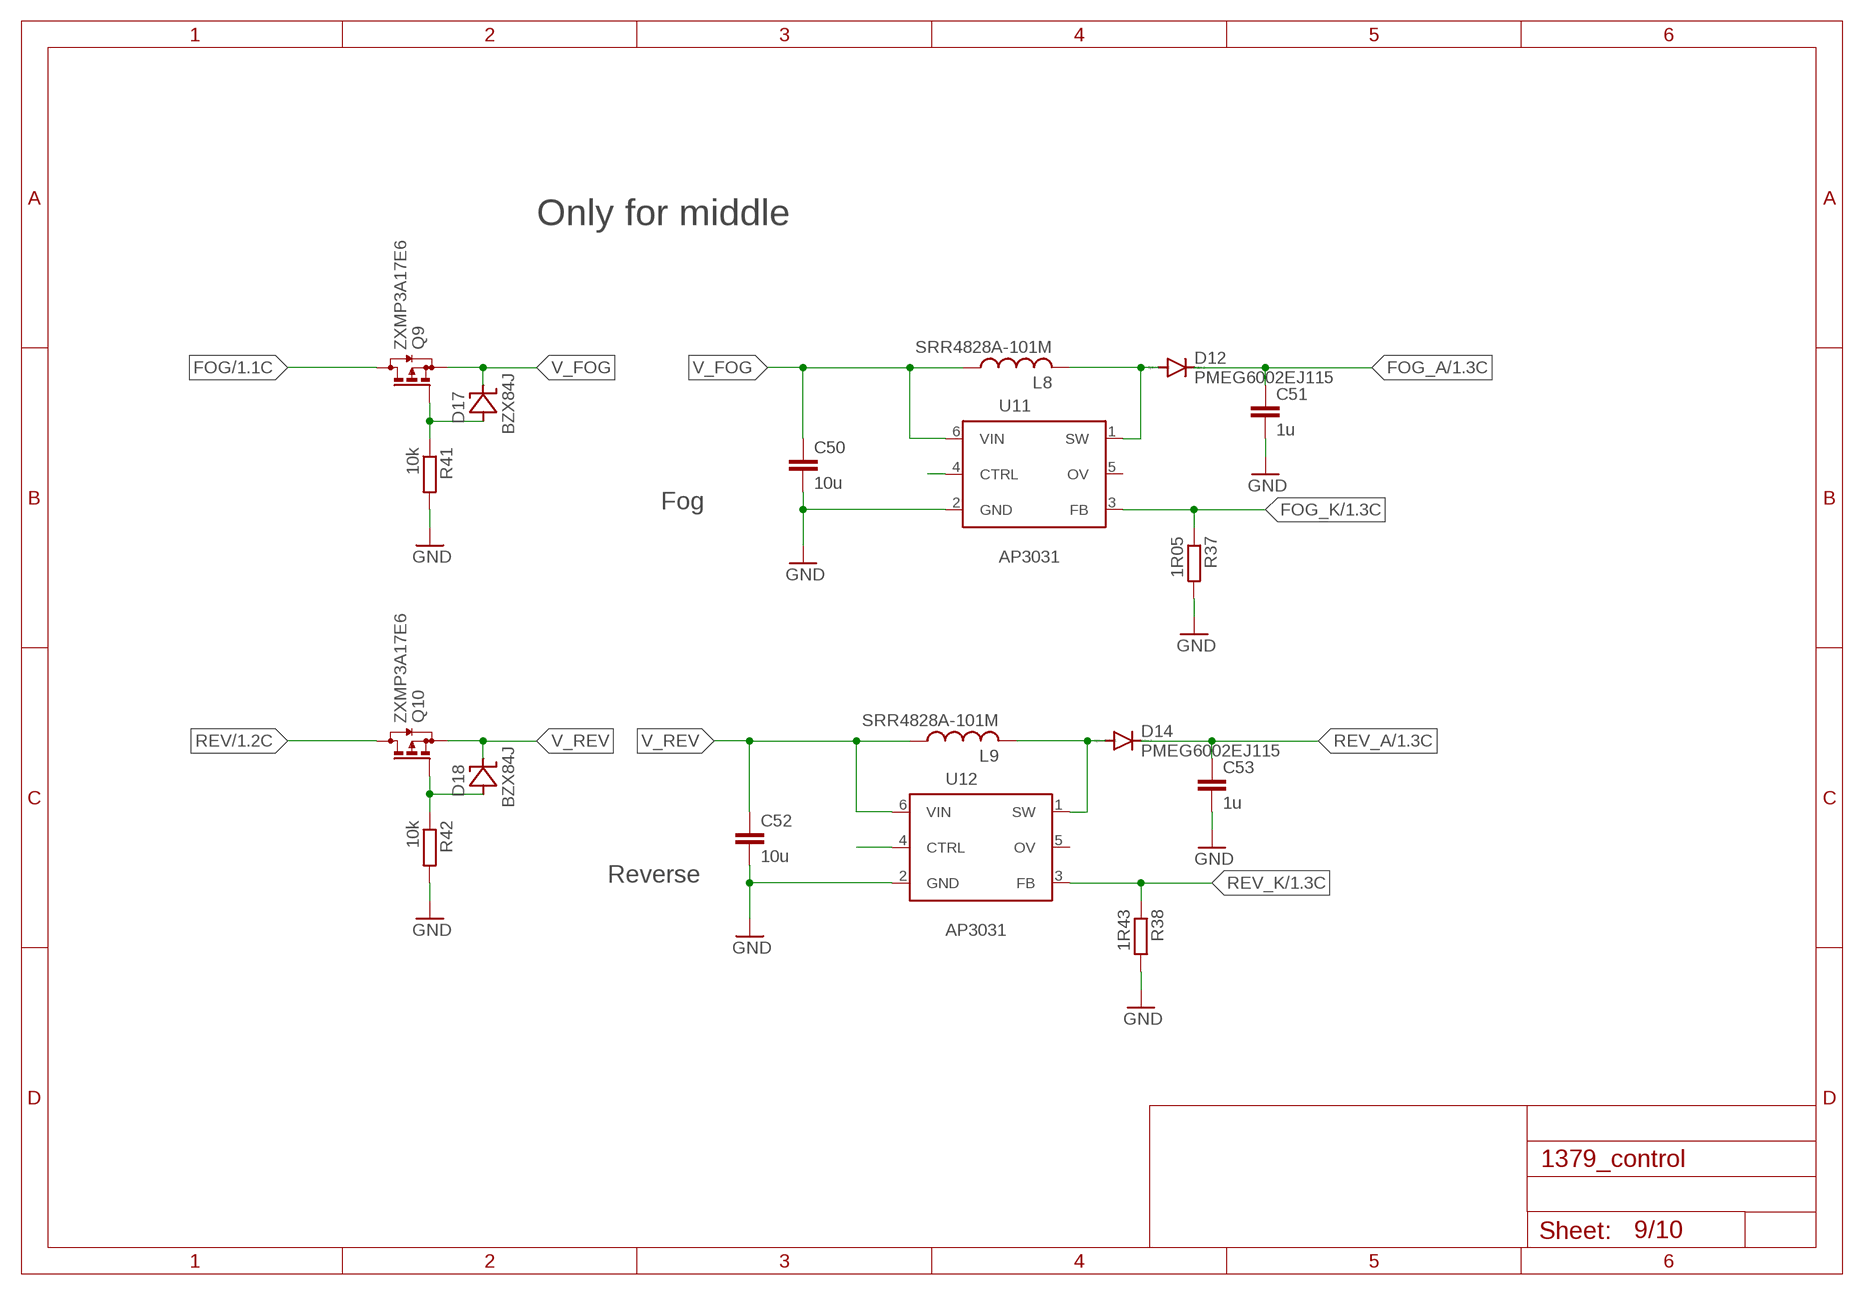
[diagram p8: schematic, sheet 9]

### Parts
C50  10u  C-EUC0805  [C0805]
C51  1u  C-EUC0805  [C0805]
C52  10u  C-EUC0805  [C0805]
C53  1u  C-EUC0805  [C0805]
D12  PMEG6002EJ115  DIODE-SOD323-R  [SOD323-R]
D14  PMEG6002EJ115  DIODE-SOD323-R  [SOD323-R]
D17  BZX84J  [SOD323]
D18  BZX84J  [SOD323]
L8  SRR4828A-101M  POWER_INDUCTOR5X5  [L_5X5]
L9  SRR4828A-101M  POWER_INDUCTOR5X5  [L_5X5]
Q9  ZXMP3A17E6  [SOT23-6]
Q10  ZXMP3A17E6  [SOT23-6]
R37  1R05  R-EU_R0805  [R0805]
R38  1R43  R-EU_R0805  [R0805]
R41  10k  R-EU_R0603  [R0603]
R42  10k  R-EU_R0603  [R0603]
U11  AP3031  [SOT23-6]
U12  AP3031  [SOT23-6]

### Nets
FOG: Q9.1(D) Q9.2(D) Q9.5(D) Q9.6(D) ; also sheet 1
FOG_A: C51.1 D12.C ; also sheet 1
FOG_K: R37.1 U11.3(FB) ; also sheet 1
GND: C50.2 C51.2 C52.2 C53.2 R37.2 R38.2 R41.2 R42.2 U11.2(GND) U12.2(GND) ; also sheet 1,2,3,4,5,6,7,8,10
N$14: U11.4(CTRL)
N$33: U12.4(CTRL)
N$56: D12.A L8.2 U11.1(SW)
N$57: D14.A L9.2 U12.1(SW)
N$60: D17.A Q9.3(G) R41.1
N$61: D18.A Q10.3(G) R42.1
REV: Q10.1(D) Q10.2(D) Q10.5(D) Q10.6(D) ; also sheet 1
REV_A: C53.1 D14.C ; also sheet 1
REV_K: R38.1 U12.3(FB) ; also sheet 1
V_FOG: C50.1 D17.C L8.1 Q9.4(S) U11.6(VIN)
V_REV: C52.1 D18.C L9.1 Q10.4(S) U12.6(VIN)
Unconnected: U11.5(OV) U12.5(OV)

### Notes on the sheet
- Only for middle
- Fog
- Reverse

## Sheet 10 of 10
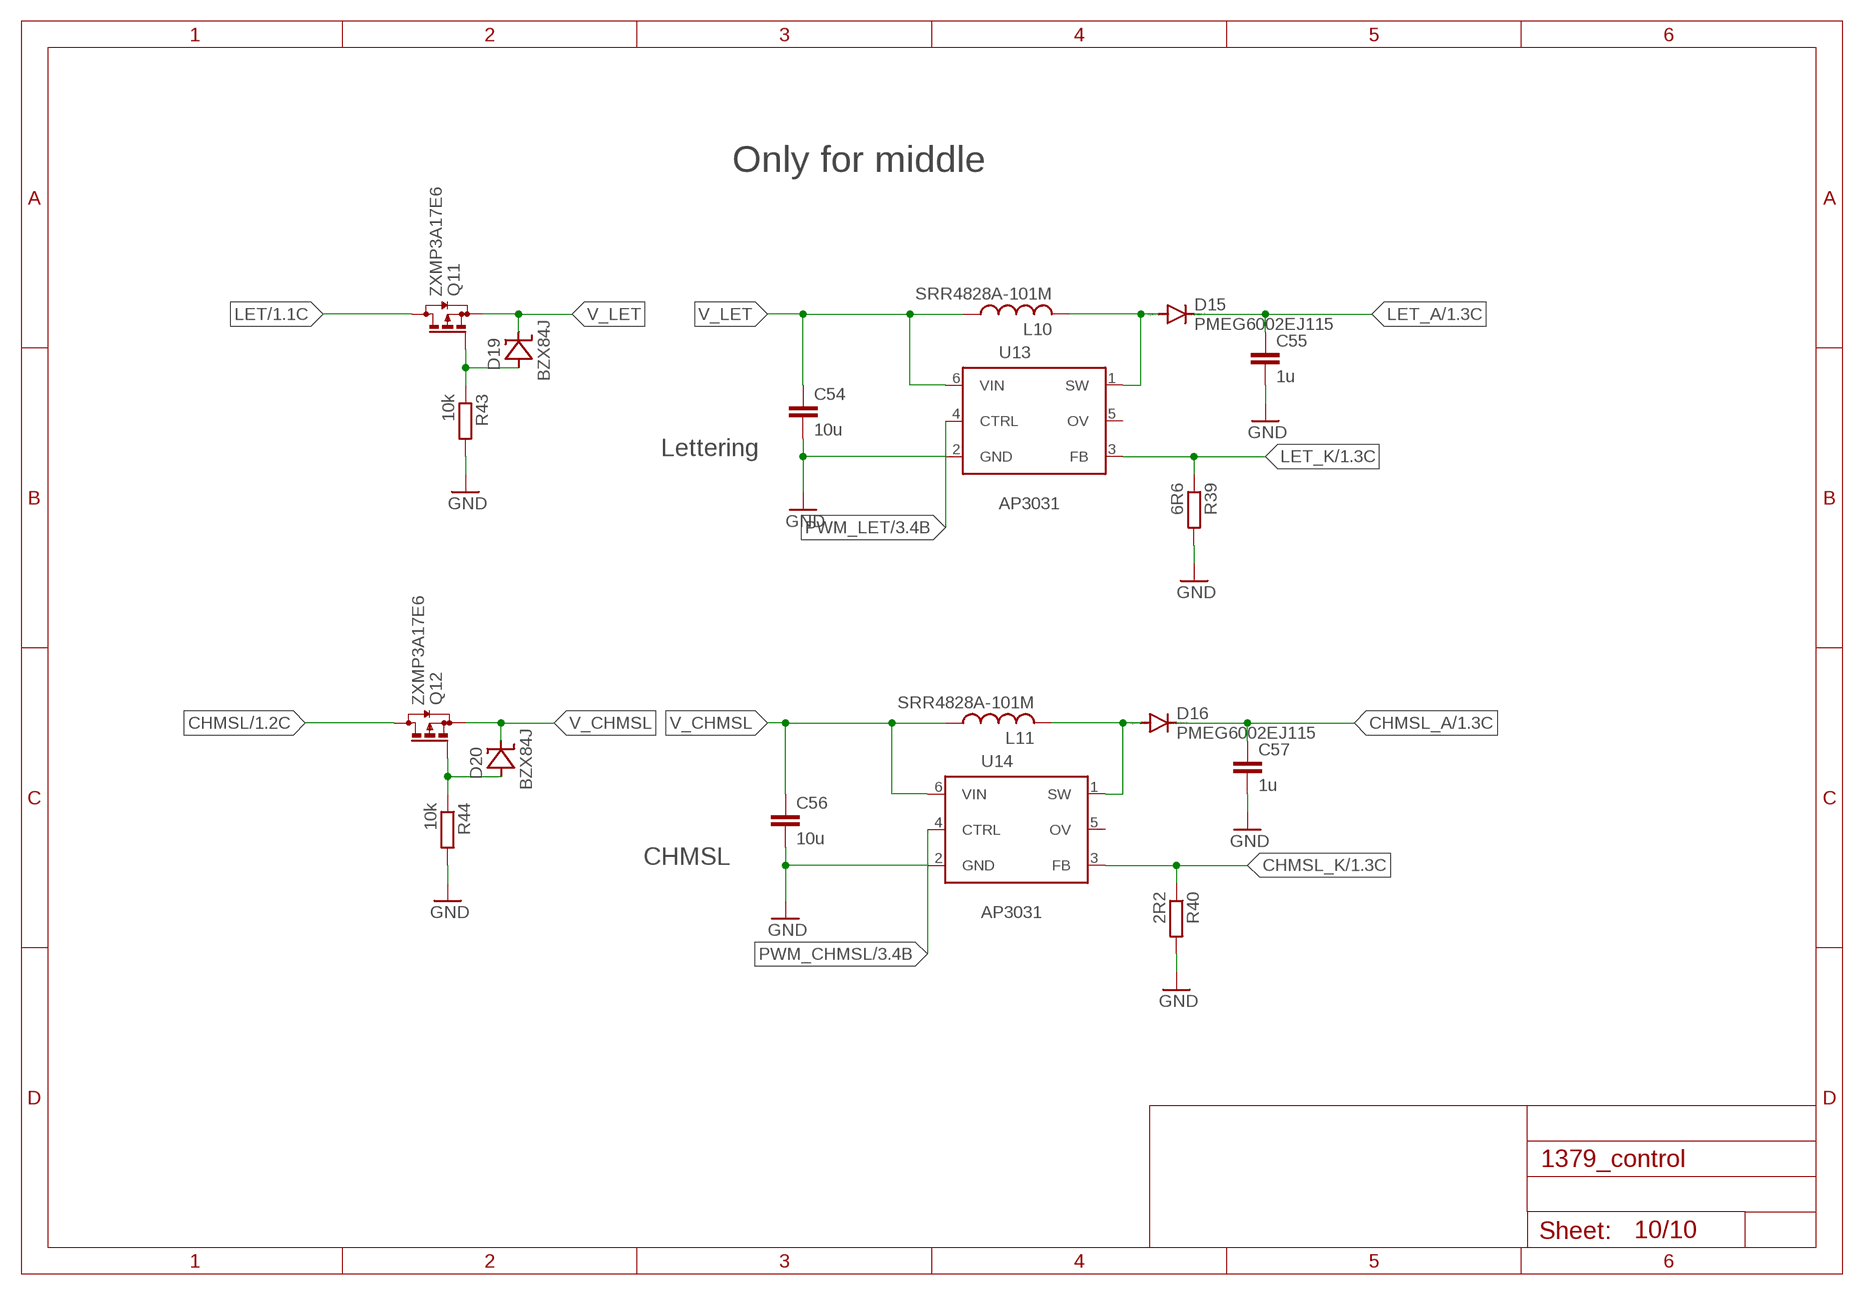
[diagram p9: schematic, sheet 10]

### Parts
C54  10u  C-EUC0805  [C0805]
C55  1u  C-EUC0805  [C0805]
C56  10u  C-EUC0805  [C0805]
C57  1u  C-EUC0805  [C0805]
D15  PMEG6002EJ115  DIODE-SOD323-R  [SOD323-R]
D16  PMEG6002EJ115  DIODE-SOD323-R  [SOD323-R]
D19  BZX84J  [SOD323]
D20  BZX84J  [SOD323]
L10  SRR4828A-101M  POWER_INDUCTOR5X5  [L_5X5]
L11  SRR4828A-101M  POWER_INDUCTOR5X5  [L_5X5]
Q11  ZXMP3A17E6  [SOT23-6]
Q12  ZXMP3A17E6  [SOT23-6]
R39  6R6  R-EU_R0805  [R0805]
R40  2R2  R-EU_R0805  [R0805]
R43  10k  R-EU_R0603  [R0603]
R44  10k  R-EU_R0603  [R0603]
U13  AP3031  [SOT23-6]
U14  AP3031  [SOT23-6]

### Nets
CHMSL: Q12.1(D) Q12.2(D) Q12.5(D) Q12.6(D) ; also sheet 1
CHMSL_A: C57.1 D16.C ; also sheet 1
CHMSL_K: R40.1 U14.3(FB) ; also sheet 1
GND: C54.2 C55.2 C56.2 C57.2 R39.2 R40.2 R43.2 R44.2 U13.2(GND) U14.2(GND) ; also sheet 1,2,3,4,5,6,7,8,9
LET: Q11.1(D) Q11.2(D) Q11.5(D) Q11.6(D) ; also sheet 1
LET_A: C55.1 D15.C ; also sheet 1
LET_K: R39.1 U13.3(FB) ; also sheet 1
N$58: D15.A L10.2 U13.1(SW)
N$59: D16.A L11.2 U14.1(SW)
N$62: D19.A Q11.3(G) R43.1
N$63: D20.A Q12.3(G) R44.1
PWM_CHMSL: U14.4(CTRL) ; also sheet 3
PWM_LET: U13.4(CTRL) ; also sheet 3
V_CHMSL: C56.1 D20.C L11.1 Q12.4(S) U14.6(VIN)
V_LET: C54.1 D19.C L10.1 Q11.4(S) U13.6(VIN)
Unconnected: U13.5(OV) U14.5(OV)

### Notes on the sheet
- Only for middle
- Lettering
- CHMSL

## Power pins joined to a net without a drawn wire
FLAG: U2.14(FLAG)
PWM: U6.15(PWM)
RE7: U8.3(RE7)

## Library data of the parts
C1-C26 C28-C38 C40 C46-C58 = rcl:C-EU: CAPACITOR, European symbol; SPICEPREFIX: C
C27 C39 C42-C45 = rcl:C-EU: CAPACITOR, European symbol
C41 = rcl:CPOL-EU: POLARIZED CAPACITOR, European symbol; SPICEPREFIX: C
D1 D3 D5 D6 D10-D12 D14-D16 = diode:DIODE-: DIODE
D7-D9 D13 D17-D20 = untitled:BZX84J
JP1 = pinhead:PINHD-1X4: PIN HEADER
JP2 JP5 = pinhead:PINHD-1X8: PIN HEADER
JP3 = pinhead:PINHD-1X11: PIN HEADER
L1-L11 = untitled:POWER_INDUCTOR
Q1 Q2 = untitled:ZXMN6A08E6
Q3 = 1305-boost:IRLML0100TR
Q4-Q12 = 1305-boost:ZXMP3A17E6
R1-R15 R18 R19 R21 R22 R32 R37-R45 R54-R56 = rcl:R-EU_: RESISTOR, European symbol; SPICEPREFIX: R
R16 R17 R20 R24-R31 R33 R34 R52 R53 = rcl:R-EU_: RESISTOR, European symbol
RN1-RN4 = resistor-dil:4R-N: Array Chip Resistor Source: RS Component / Phycomp; OC_FARNELL: unknown; OC_NEWARK: unknown
S1 S4 S6 = SparkFun-Switches:SWITCH-SPDT: Single Pole, Double Throw (SPDT) Switch Single-pole, double-throw (SPDT) switch. Variant Overview SMD-AYZ0202 Surface Mount DPDT Switch <https://www.sparkfun.com/products/597> (COM-00597) Used on e.g. LilyPad Arduino USB - ATmega32U4 Board <https://www.sparkfun.com/products/12049> PTH-11.6X4.0MM SPDT Mini Power Switch <https://www.sparkfun.com/products/102> (COM-00102) Used on e.g. SparkFun Simon Says - Through-Hole Soldering Kit <https://www.sparkfun.com/products/10547> (KIT-10547) PTH-11.6X4.0MM-KIT KIT version of SPDT Mini Power Switch - Simplifies soldering by removing tStop of switch pins - only one side can be soldered. PTH-11.6X4.0MM-LOCK LOCK version of SPDT Mini Power Switch - Offset pins hold switch in place for easier soldering. SMD-RIGHT-ANGLE Surface Mount Right Angle Switch <https://www.sparkfun.com/products/10860> (COM-10860) Used on e.g. SparkFun ESP8266 Thing <https://www.sparkfun.com/products/13231>; PROD_ID: SWCH-08261; SF_SKU: COM-00102
S2 = SparkFun-Switches:MOMENTARY-SWITCH-SPST: Momentary Switch (Pushbutton) - SPST Normally-open (NO) SPST momentary switches (buttons, pushbuttons). Variants PTH-12MM - 12mm square, through-hole Momentary Pushbutton Switch - 12mm Square <https://www.sparkfun.com/products/9190> (COM-09190) PTH-6.0MM, PTH-6.0MM-KIT - 6.0mm square, through-hole Mini Pushbutton Switch <https://www.sparkfun.com/products/97> (COM-00097) KIT package intended for soldering kit's - only one side of pads' copper is exposed. PTH-RIGHT-ANGLE-KIT - Right-angle, through-hole Right Angle Tactile Button <https://www.sparkfun.com/products/10791> - Used on SparkFun BigTime Watch Kit <https://www.sparkfun.com/products/11734> SMD-12MM - 12mm square, surface-mount Tactile Button - SMD (12mm) <https://www.sparkfun.com/products/12993> (COM-12993) Used on SparkFun PicoBoard <https://www.sparkfun.com/products/11888> SMD-4.5MM - 4.5mm Square Trackball Switch Used on SparkFun Blackberry Trackballer Breakout <https://www.sparkfun.com/products/13169> SMD-4.6MMX2.8MM - 4.60mm x 2.80mm, surface mount Used on SparkFun SAMD21 Mini Breakout <https://www.sparkfun.com/products/13664> SMD-5.2MM, SMD-5.2-REDUNDANT - 5.2mm square, surface-mount Mini Pushbutton Switch - SMD <https://www.sparkfun.com/products/8720> (COM-08720) Used on Arduino Pro Mini <https://www.sparkfun.com/products/11114> REDUNDANT package connects both switch circuits together SMD-6.0X3.5MM - 6.0 x 3.5mm, surface mount Momentary Reset Switch SMD <https://www.sparkfun.com/products/8229> (COM-08229) SMD-6.2MM-TALL - 6.2mm square, surface mount Tactile Button - SMD (6mm) <https://www.sparkfun.com/products/12992> Used on SparkFun Digital Sandbox <https://www.sparkfun.com/products/12651> SMD-RIGHT-ANGLE - Right-angle, surface mount Used on SparkFun Block for Intel® Edison - Arduino <https://www.sparkfun.com/products/13036>; PROD_ID: SWCH-08441; SF_SKU: COM-00097
S3 = smd-special:SWS001: SMD Dip Switch 1 pol.
S7 = untitled:DPDT
T3 = zetex:NMOSSOT23: MOS FET; OC_FARNELL: unknown; OC_NEWARK: unknown
U1 U3-U5 U11-U14 = untitled:AP3031
U2 U6 = untitled:ZXLD1370Q
U7 = untitled:PCA9685PW,118: 16-channel, 12-bit PWM Fm+ I2C-bus LED controller Check availability <https://pricing.snapeda.com/parts/PCA9685PW%2C118/NXP%20USA/view-part?ref=eda>; AVAILABILITY: In Stock; DESCRIPTION: LED Driver IC 16 Output Linear - PWM Dimming 25mA 28-TSSOP; MF: NXP USA; MP: PCA9685PW,118; PACKAGE: TSSOP-28 NXP Semiconductors; PRICE: None; PURCHASE-URL: https://pricing.snapeda.com/search/part/PCA9685PW,118/?ref=eda
U8 = untitled:PIC32MX120F064H
U9 = untitled:LMR51420
U10 = untitled:ST-M24256E-FMN6TP
X1 = untitled:ENODER_ROTARY
X2 = _con-JST-PA:BM05B-PASS
X3 = untitled:ENCODER-2
Y1 = Wurth_Quartz Crystals & Oscillators_WE-SPXO:WE-SPXO_CFPS-104: WE-SPXO Simple Packaged Quartz Oscillator Characteristics SMT models Hermetically sealed Frequencies between 3.6864 MHz and 125 MHz Maximum operating temperatures range:-40 °C to 85 °C Stabilities down to ± 25 ppm available Available supply voltages: 1.8 V, 3.3 V and 5 V Available output signal types: CMOS; HCMOS; HCMOS/TTL Applications Microprocessor Wireless Communication Devices Industrial Devices Real Time Clocks Wired Communication (e.g. Ethernet and USB) IoT Optical Network Audio and Multimedia Devices Test and Measurement Equipment Navigation and Locators <https://www.we-online.com/catalog/media/o135918v209%20Family_WE-SPXO.jpg> Details see: https://www.we-online.com/catalog/en/WE-SPXO Created by Ella Wu, 2020-11-23 2020 (C) Wurth Elektronik; DATASHEET-URL: https://www.we-online.com/catalog/datasheet/830205028309.pdf; MOUNT: SMT; PART-NUMBER: 830205028309; STABILITY: 25ppm; V-SUPPLY: 3.3V; VALUE: 32.768kHz